# EAGLE design ReSpeaker_Switch_V02 (EAGLE 9.3.0)

## Sheet 1 of 2
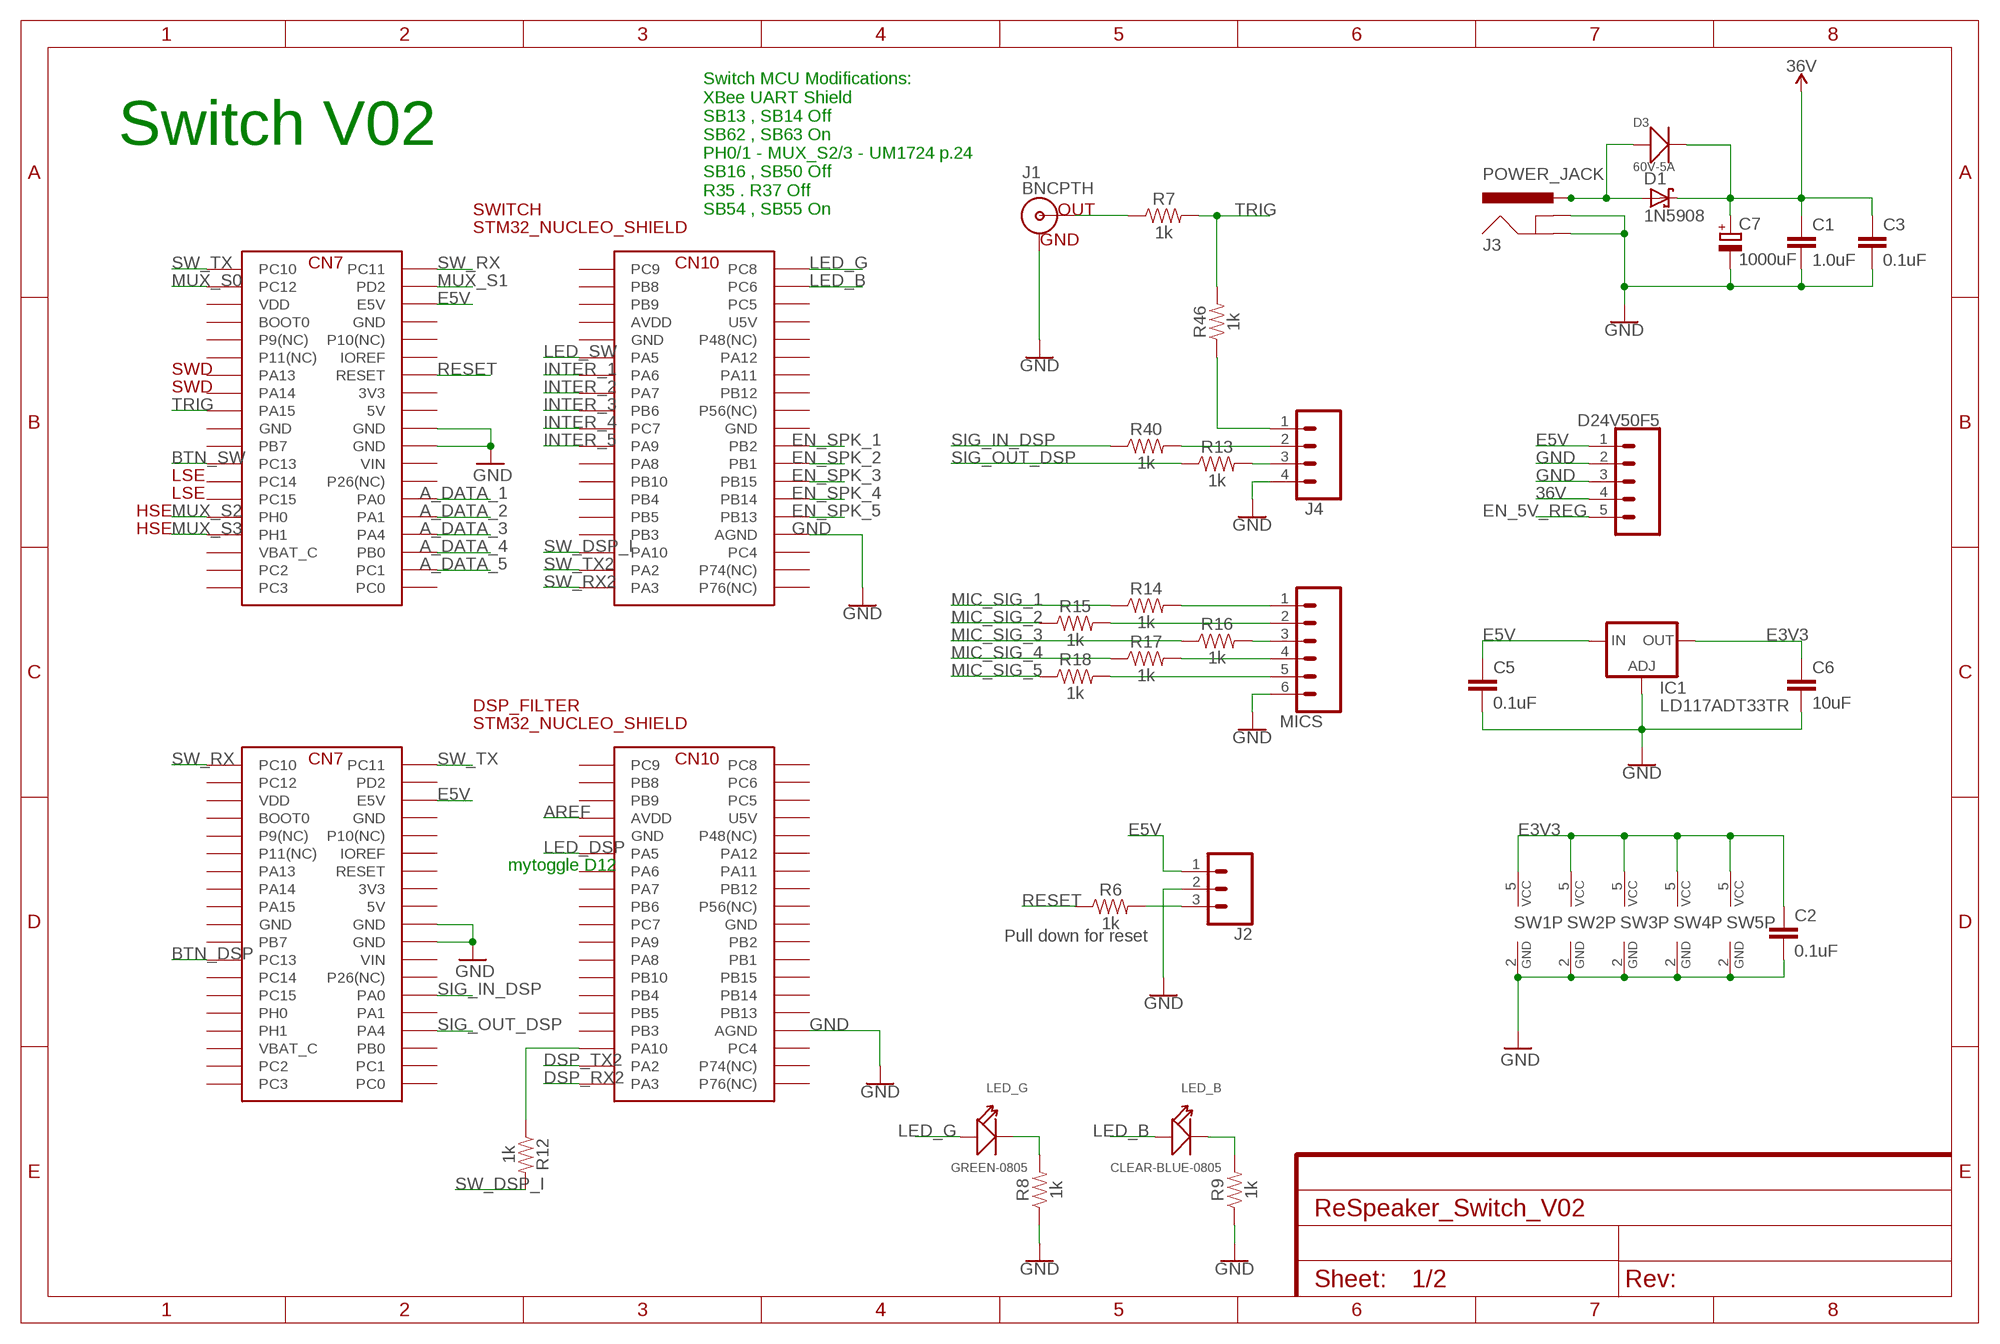
[diagram p0: schematic, sheet 1]

### Parts
C1  1.0uF  1.0UF-0805-25V-10%  [0805]
C2  0.1uF  1.0UF-0805-25V-10%  [0805]
C3  0.1uF  1.0UF-0805-25V-10%  [0805]
C5  0.1uF  1.0UF-0805-25V-10%  [0805]
C6  10uF  1.0UF-0805-25V-10%  [0805]
C7  1000uF  CPOL-EUE7.5-16  [E7,5-16]
D1  1N5908  [C4111-15]
D3  60V-5A  SMD-DIODE-SCHOTTKY-40V-3A(DO-214AB)  [DO-214AB]
D24V50F5  CONN_05  [1X05]
DSP_FILTER  STM32_NUCLEO_SHIELD  [STM32_NUCLEO]
IC1  LD117ADT33TR  [DPACK]
J1  BNCPTH  [BNC]
J2  CONN_03POLAR  [MOLEX-1X3]
J3  POWER_JACK  [POWER_JACK_PTH]
J4  CONN_04POLAR  [MOLEX-1X4]
LED_B  CLEAR-BLUE-0805  SMD-LED-CLEAR-BLUE(0805)  [LED-0805]
LED_G  GREEN-0805  SMD-LED-CLEAR-GREEN(0805)  [LED-0805]
MICS  CONN_06POLAR  [MOLEX-1X6]
R6  1k  RESISTOR0805  [0805]
R7  1k  RESISTOR0805  [0805]
R8  1k  RESISTOR0805  [0805]
R9  1k  RESISTOR0805  [0805]
R12  1k  RESISTOR0805  [0805]
R13  1k  RESISTOR0805  [0805]
R14  1k  RESISTOR0805  [0805]
R15  1k  RESISTOR0805  [0805]
R16  1k  RESISTOR0805  [0805]
R17  1k  RESISTOR0805  [0805]
R18  1k  RESISTOR0805  [0805]
R40  1k  RESISTOR0805  [0805]
R46  1k  RESISTOR0805  [0805]
SW1  741G3157DBVR  [DBV_R-PDSO-G6]
SW2  741G3157DBVR  [DBV_R-PDSO-G6]
SW3  741G3157DBVR  [DBV_R-PDSO-G6]
SW4  741G3157DBVR  [DBV_R-PDSO-G6]
SW5  741G3157DBVR  [DBV_R-PDSO-G6]
SWITCH  STM32_NUCLEO_SHIELD  [STM32_NUCLEO]

### Nets
36V: C1.1 C3.1 C7.+ D1.C D3.2(-) D24V50F5.4 ; also sheet 2
A_DATA_1: SWITCH.PA0 ; also sheet 2
A_DATA_2: SWITCH.PA1 ; also sheet 2
A_DATA_3: SWITCH.PA4 ; also sheet 2
A_DATA_4: SWITCH.PB0 ; also sheet 2
A_DATA_5: SWITCH.PC1 ; also sheet 2
AREF: DSP_FILTER.AVDD
BTN_DSP: DSP_FILTER.PC13
BTN_SW: SWITCH.PC13
DSP_RX2: DSP_FILTER.PA3
DSP_TX2: DSP_FILTER.PA2
E3V3: C2.1 C6.1 IC1.4(OUT) SW1.5(VCC) SW2.5(VCC) SW3.5(VCC) SW4.5(VCC) SW5.5(VCC) ; also sheet 2
E5V: C5.1 D24V50F5.1 DSP_FILTER.E5V IC1.3(IN) J2.1 SWITCH.E5V ; also sheet 2
EN_5V_REG: D24V50F5.5
EN_SPK_1: SWITCH.PB2 ; also sheet 2
EN_SPK_2: SWITCH.PB1 ; also sheet 2
EN_SPK_3: SWITCH.PB15 ; also sheet 2
EN_SPK_4: SWITCH.PB14 ; also sheet 2
EN_SPK_5: SWITCH.PB13 ; also sheet 2
GND [Power]: C1.2 C2.2 C3.2 C5.2 C6.2 C7.- D24V50F5.2 D24V50F5.3 DSP_FILTER.AGND DSP_FILTER.GND@20(GND) DSP_FILTER.GND@22(GND) IC1.1(ADJ) J1.GND J2.2 J3.GND J3.GNDBREAK J4.4 MICS.6 R8.1 R9.1 SW1.2(GND) SW2.2(GND) SW3.2(GND) SW4.2(GND) SW5.2(GND) SWITCH.AGND SWITCH.GND@20(GND) SWITCH.GND@22(GND) ; also sheet 2
INTER_1: SWITCH.PA6 ; also sheet 2
INTER_2: SWITCH.PA7 ; also sheet 2
INTER_3: SWITCH.PB6 ; also sheet 2
INTER_4: SWITCH.PC7 ; also sheet 2
INTER_5: SWITCH.PA9 ; also sheet 2
LED_B: LED_B.+ SWITCH.PC6
LED_DSP: DSP_FILTER.PA5
LED_G: LED_G.+ SWITCH.PC8
LED_SW: SWITCH.PA5
MIC_SIG_1: R14.1 ; also sheet 2
MIC_SIG_2: R15.1 ; also sheet 2
MIC_SIG_3: R16.1 ; also sheet 2
MIC_SIG_4: R17.1 ; also sheet 2
MIC_SIG_5: R18.1 ; also sheet 2
MUX_S0: SWITCH.PC12 ; also sheet 2
MUX_S1: SWITCH.PD2 ; also sheet 2
MUX_S2: SWITCH.PH0 ; also sheet 2
MUX_S3: SWITCH.PH1 ; also sheet 2
N$1: DSP_FILTER.PA10 R12.1
N$2: D1.A D3.1(+) J3.PWR
N$6: J1.S(OUT) R7.1
N$9: J2.3 R6.2
N$10: MICS.1 R14.2
N$11: LED_G.- R8.2
N$12: LED_B.- R9.2
N$13: MICS.2 R15.2
N$14: MICS.3 R16.2
N$15: MICS.4 R17.2
N$16: MICS.5 R18.2
N$17: J4.2 R40.2
N$32: J4.3 R13.2
N$34: J4.1 R46.1
RESET: R6.1 SWITCH.RESET
SIG_IN_DSP: DSP_FILTER.PA0 R40.1 ; also sheet 2
SIG_OUT_DSP: DSP_FILTER.PA4 R13.1 ; also sheet 2
SW_DSP_I: R12.2 SWITCH.PA10
SW_RX: DSP_FILTER.PC10 SWITCH.PC11
SW_RX2: SWITCH.PA3
SW_TX: DSP_FILTER.PC11 SWITCH.PC10
SW_TX2: SWITCH.PA2
TRIG: R7.2 R46.2 SWITCH.PA15
Unconnected: DSP_FILTER.BOOT0 DSP_FILTER.IOREF DSP_FILTER.P9(NC) DSP_FILTER.P10(NC) DSP_FILTER.P11(NC) DSP_FILTER.P26(NC) DSP_FILTER.P48(NC) DSP_FILTER.P56(NC) DSP_FILTER.P74(NC) DSP_FILTER.P76(NC) DSP_FILTER.PA1 DSP_FILTER.PA6 DSP_FILTER.PA7 DSP_FILTER.PA8 DSP_FILTER.PA9 DSP_FILTER.PA11 DSP_FILTER.PA12 DSP_FILTER.PA13 DSP_FILTER.PA14 DSP_FILTER.PA15 DSP_FILTER.PB0 DSP_FILTER.PB1 DSP_FILTER.PB2 DSP_FILTER.PB3 DSP_FILTER.PB4 DSP_FILTER.PB5 DSP_FILTER.PB6 DSP_FILTER.PB7 DSP_FILTER.PB8 DSP_FILTER.PB9 DSP_FILTER.PB10 DSP_FILTER.PB12 DSP_FILTER.PB13 DSP_FILTER.PB14 DSP_FILTER.PB15 DSP_FILTER.PC0 DSP_FILTER.PC1 DSP_FILTER.PC2 DSP_FILTER.PC3 DSP_FILTER.PC4 DSP_FILTER.PC5 DSP_FILTER.PC6 DSP_FILTER.PC7 DSP_FILTER.PC8 DSP_FILTER.PC9 DSP_FILTER.PC12 DSP_FILTER.PC14 DSP_FILTER.PC15 DSP_FILTER.PD2 DSP_FILTER.PH0 DSP_FILTER.PH1 DSP_FILTER.RESET SWITCH.BOOT0 SWITCH.IOREF SWITCH.P9(NC) SWITCH.P10(NC) SWITCH.P11(NC) SWITCH.P26(NC) SWITCH.P48(NC) SWITCH.P56(NC) SWITCH.P74(NC) SWITCH.P76(NC) SWITCH.PA8 SWITCH.PA11 SWITCH.PA12 SWITCH.PA13 SWITCH.PA14 SWITCH.PB3 SWITCH.PB4 SWITCH.PB5 SWITCH.PB7 SWITCH.PB8 SWITCH.PB9 SWITCH.PB10 SWITCH.PB12 SWITCH.PC0 SWITCH.PC2 SWITCH.PC3 SWITCH.PC4 SWITCH.PC5 SWITCH.PC9 SWITCH.PC14 SWITCH.PC15

### Notes on the sheet
- Switch V02
- Switch MCU Modifications:
  XBee UART Shield 
  SB13 , SB14 Off
  SB62 , SB63 On
  PH0/1 - MUX_S2/3 - UM1724 p.24
  SB16 , SB50 Off
  R35 . R37 Off
  SB54 , SB55 On
- SWD
- SWD
- LSE
- LSE
- HSE
- HSE
- mytoggle D12
- Pull down for reset

## Sheet 2 of 2
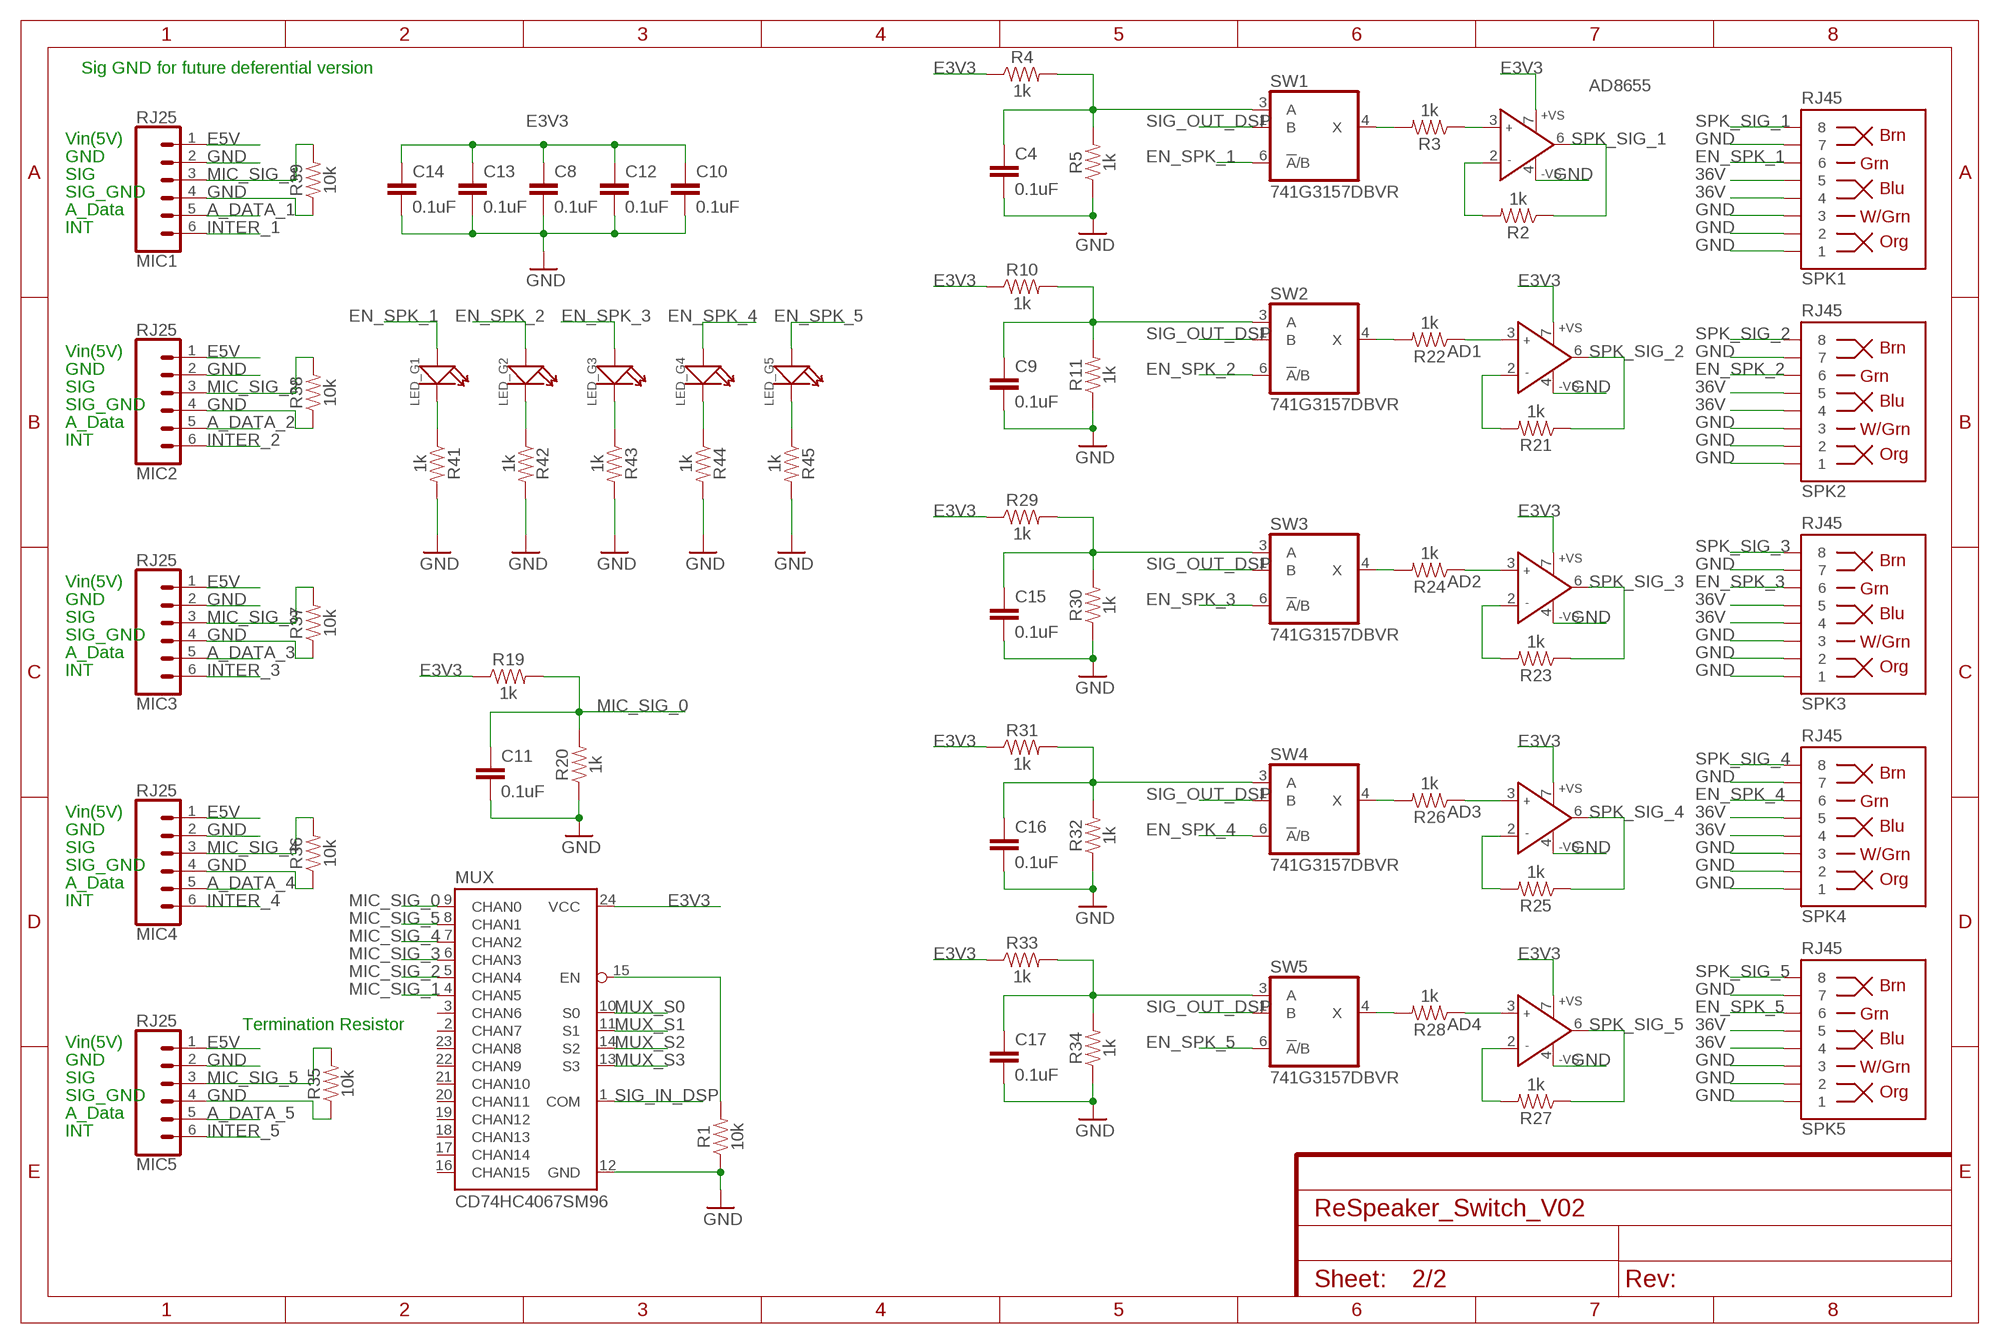
[diagram p1: schematic, sheet 2]

### Parts
AD1  AD8655R  [SO8]
AD2  AD8655R  [SO8]
AD3  AD8655R  [SO8]
AD4  AD8655R  [SO8]
AD8655  AD8655R  [SO8]
C4  0.1uF  1.0UF-0805-25V-10%  [0805]
C8  0.1uF  1.0UF-0805-25V-10%  [0805]
C9  0.1uF  1.0UF-0805-25V-10%  [0805]
C10  0.1uF  1.0UF-0805-25V-10%  [0805]
C11  0.1uF  1.0UF-0805-25V-10%  [0805]
C12  0.1uF  1.0UF-0805-25V-10%  [0805]
C13  0.1uF  1.0UF-0805-25V-10%  [0805]
C14  0.1uF  1.0UF-0805-25V-10%  [0805]
C15  0.1uF  1.0UF-0805-25V-10%  [0805]
C16  0.1uF  1.0UF-0805-25V-10%  [0805]
C17  0.1uF  1.0UF-0805-25V-10%  [0805]
LED_G1  GREEN-0805  SMD-LED-CLEAR-GREEN(0805)  [LED-0805]
LED_G2  GREEN-0805  SMD-LED-CLEAR-GREEN(0805)  [LED-0805]
LED_G3  GREEN-0805  SMD-LED-CLEAR-GREEN(0805)  [LED-0805]
LED_G4  GREEN-0805  SMD-LED-CLEAR-GREEN(0805)  [LED-0805]
LED_G5  GREEN-0805  SMD-LED-CLEAR-GREEN(0805)  [LED-0805]
MIC1  RJ25  RJ11-6  [RJ11-6]
MIC2  RJ25  RJ11-6  [RJ11-6]
MIC3  RJ25  RJ11-6  [RJ11-6]
MIC4  RJ25  RJ11-6  [RJ11-6]
MIC5  RJ25  RJ11-6  [RJ11-6]
MUX  CD74HC4067SM96  74HC4067SM96  [SSOP24]
R1  10k  RESISTOR0805  [0805]
R2  1k  RESISTOR0805  [0805]
R3  1k  RESISTOR0805  [0805]
R4  1k  RESISTOR0805  [0805]
R5  1k  RESISTOR0805  [0805]
R10  1k  RESISTOR0805  [0805]
R11  1k  RESISTOR0805  [0805]
R19  1k  RESISTOR0805  [0805]
R20  1k  RESISTOR0805  [0805]
R21  1k  RESISTOR0805  [0805]
R22  1k  RESISTOR0805  [0805]
R23  1k  RESISTOR0805  [0805]
R24  1k  RESISTOR0805  [0805]
R25  1k  RESISTOR0805  [0805]
R26  1k  RESISTOR0805  [0805]
R27  1k  RESISTOR0805  [0805]
R28  1k  RESISTOR0805  [0805]
R29  1k  RESISTOR0805  [0805]
R30  1k  RESISTOR0805  [0805]
R31  1k  RESISTOR0805  [0805]
R32  1k  RESISTOR0805  [0805]
R33  1k  RESISTOR0805  [0805]
R34  1k  RESISTOR0805  [0805]
R35  10k  RESISTOR0805  [0805]
R36  10k  RESISTOR0805  [0805]
R37  10k  RESISTOR0805  [0805]
R38  10k  RESISTOR0805  [0805]
R39  10k  RESISTOR0805  [0805]
R41  1k  RESISTOR0805  [0805]
R42  1k  RESISTOR0805  [0805]
R43  1k  RESISTOR0805  [0805]
R44  1k  RESISTOR0805  [0805]
R45  1k  RESISTOR0805  [0805]
SPK1  RJ45  RJ45-8  [RJ45-8]
SPK2  RJ45  RJ45-8  [RJ45-8]
SPK3  RJ45  RJ45-8  [RJ45-8]
SPK4  RJ45  RJ45-8  [RJ45-8]
SPK5  RJ45  RJ45-8  [RJ45-8]

### Nets
36V: SPK1.4 SPK1.5 SPK2.4 SPK2.5 SPK3.4 SPK3.5 SPK4.4 SPK4.5 SPK5.4 SPK5.5 ; also sheet 1
A_DATA_1: MIC1.5 ; also sheet 1
A_DATA_2: MIC2.5 ; also sheet 1
A_DATA_3: MIC3.5 ; also sheet 1
A_DATA_4: MIC4.5 ; also sheet 1
A_DATA_5: MIC5.5 ; also sheet 1
E3V3: AD1.7(+VS) AD2.7(+VS) AD3.7(+VS) AD4.7(+VS) AD8655.7(+VS) C8.1 C10.1 C12.1 C13.1 C14.1 MUX.24(VCC) R4.1 R10.1 R19.1 R29.1 R31.1 R33.1 ; also sheet 1
E5V: MIC1.1 MIC2.1 MIC3.1 MIC4.1 MIC5.1 ; also sheet 1
EN_MUX: MUX.15(EN) R1.2
EN_SPK_1: LED_G1.+ SPK1.6 SW1.6(!A!/B) ; also sheet 1
EN_SPK_2: LED_G2.+ SPK2.6 SW2.6(!A!/B) ; also sheet 1
EN_SPK_3: LED_G3.+ SPK3.6 SW3.6(!A!/B) ; also sheet 1
EN_SPK_4: LED_G4.+ SPK4.6 SW4.6(!A!/B) ; also sheet 1
EN_SPK_5: LED_G5.+ SPK5.6 SW5.6(!A!/B) ; also sheet 1
GND [Power]: AD1.4(-VS) AD2.4(-VS) AD3.4(-VS) AD4.4(-VS) AD8655.4(-VS) C4.2 C8.2 C9.2 C10.2 C11.2 C12.2 C13.2 C14.2 C15.2 C16.2 C17.2 MIC1.2 MIC1.4 MIC2.2 MIC2.4 MIC3.2 MIC3.4 MIC4.2 MIC4.4 MIC5.2 MIC5.4 MUX.12(GND) R1.1 R5.1 R11.1 R20.1 R30.1 R32.1 R34.1 R35.1 R36.1 R37.1 R38.1 R39.1 R41.2 R42.2 R43.2 R44.2 R45.2 SPK1.1 SPK1.2 SPK1.3 SPK1.7 SPK2.1 SPK2.2 SPK2.3 SPK2.7 SPK3.1 SPK3.2 SPK3.3 SPK3.7 SPK4.1 SPK4.2 SPK4.3 SPK4.7 SPK5.1 SPK5.2 SPK5.3 SPK5.7 ; also sheet 1
INTER_1: MIC1.6 ; also sheet 1
INTER_2: MIC2.6 ; also sheet 1
INTER_3: MIC3.6 ; also sheet 1
INTER_4: MIC4.6 ; also sheet 1
INTER_5: MIC5.6 ; also sheet 1
MIC_SIG_0: C11.1 MUX.9(CHAN0) R19.2 R20.2
MIC_SIG_1: MIC1.3 MUX.4(CHAN5) R39.2 ; also sheet 1
MIC_SIG_2: MIC2.3 MUX.5(CHAN4) R38.2 ; also sheet 1
MIC_SIG_3: MIC3.3 MUX.6(CHAN3) R37.2 ; also sheet 1
MIC_SIG_4: MIC4.3 MUX.7(CHAN2) R36.2 ; also sheet 1
MIC_SIG_5: MIC5.3 MUX.8(CHAN1) R35.2 ; also sheet 1
MUX_S0: MUX.10(S0) ; also sheet 1
MUX_S1: MUX.11(S1) ; also sheet 1
MUX_S2: MUX.14(S2) ; also sheet 1
MUX_S3: MUX.13(S3) ; also sheet 1
N$3: R3.2 SW1.4(X)
N$4: AD8655.3(IN+) R3.1
N$5: AD8655.2(IN-) R2.2
N$7: C4.1 R4.2 R5.2 SW1.3(A)
N$8: C9.1 R10.2 R11.2 SW2.3(A)
N$18: AD1.2(IN-) R21.2
N$19: AD2.2(IN-) R23.2
N$20: AD1.3(IN+) R22.1
N$21: AD2.3(IN+) R24.1
N$22: AD3.2(IN-) R25.2
N$23: AD3.3(IN+) R26.1
N$24: AD4.2(IN-) R27.2
N$25: AD4.3(IN+) R28.1
N$26: C15.1 R29.2 R30.2 SW3.3(A)
N$27: R22.2 SW2.4(X)
N$28: C16.1 R31.2 R32.2 SW4.3(A)
N$29: R24.2 SW3.4(X)
N$30: C17.1 R33.2 R34.2 SW5.3(A)
N$31: R26.2 SW4.4(X)
N$33: R28.2 SW5.4(X)
N$35: LED_G1.- R41.1
N$37: LED_G2.- R42.1
N$39: LED_G3.- R43.1
N$41: LED_G4.- R44.1
N$43: LED_G5.- R45.1
SIG_IN_DSP: MUX.1(COM) ; also sheet 1
SIG_OUT_DSP: SW1.1(B) SW2.1(B) SW3.1(B) SW4.1(B) SW5.1(B) ; also sheet 1
SPK_SIG_1: AD8655.6(OUT) R2.1 SPK1.8
SPK_SIG_2: AD1.6(OUT) R21.1 SPK2.8
SPK_SIG_3: AD2.6(OUT) R23.1 SPK3.8
SPK_SIG_4: AD3.6(OUT) R25.1 SPK4.8
SPK_SIG_5: AD4.6(OUT) R27.1 SPK5.8
Unconnected: MUX.2(CHAN7) MUX.3(CHAN6) MUX.16(CHAN15) MUX.17(CHAN14) MUX.18(CHAN13) MUX.19(CHAN12) MUX.20(CHAN11) MUX.21(CHAN10) MUX.22(CHAN9) MUX.23(CHAN8)

### Notes on the sheet
- Sig GND for future deferential version
- Vin(5V)
- GND
- SIG
- SIG_GND
- A_Data
- INT
- Vin(5V)
- GND
- SIG
- SIG_GND
- A_Data
- INT
- Vin(5V)
- GND
- SIG
- SIG_GND
- A_Data
- INT
- Vin(5V)
- GND
- SIG
- SIG_GND
- A_Data
- INT
- Termination Resistor
- Vin(5V)
- GND
- SIG
- SIG_GND
- A_Data
- INT

## Power pins joined to a net without a drawn wire
3V3: DSP_FILTER.3V3 SWITCH.3V3
5V: DSP_FILTER.5V SWITCH.5V
AVDD: SWITCH.AVDD
GND: DSP_FILTER.GND@8(GND) DSP_FILTER.GND@19(GND) DSP_FILTER.GND@47(GND) DSP_FILTER.GND@58(GND) SWITCH.GND@8(GND) SWITCH.GND@19(GND) SWITCH.GND@47(GND) SWITCH.GND@58(GND)
U5V: DSP_FILTER.U5V SWITCH.U5V
VBAT_C: DSP_FILTER.VBAT_C SWITCH.VBAT_C
VDD: DSP_FILTER.VDD SWITCH.VDD
VIN: DSP_FILTER.VIN SWITCH.VIN

## Library data of the parts
AD1-AD4 AD8655 = analog-devices:AD8655: Low Noise, Precision CMOS Amplifier Source: http://www.analog.com/static/imported-files/data_sheets/AD8655_8656.pdf; MF: ALTERA CORPORATION; MPN: AD8655ARMZ-REEL; OC_FARNELL: 1078267; OC_NEWARK: 59K7050
C1 = SparkFun-Capacitors:1.0UF: 1µF ceramic capacitors A capacitor is a passive two-terminal electrical component used to store electrical energy temporarily in an electric field.; PROD_ID: CAP-08064
C2-C6 C8-C17 = SparkFun-Capacitors:1.0UF: 1µF ceramic capacitors A capacitor is a passive two-terminal electrical component used to store electrical energy temporarily in an electric field.; PROD_ID: CAP-08064; VALUE: 1.0uF
C7 = rcl:CPOL-EU: POLARIZED CAPACITOR, European symbol; SPICEPREFIX: C
D1 = diode:1N5908: DIODE schottky
D3 = Seeed-OPL-Diode:SMD-DIODE-SCHOTTKY-40V-3A(DO-214AB): 304020018; MPN: SS34-E3/57T; VALUE: 40V-3A
D24V50F5 = SparkFun-Connectors:CONN_05: Multi connection point. Often used as Generic Header-pin footprint for 0.1 inch spaced/style header connections On any of the 0.1 inch spaced packages, you can populate with these: Break Away Headers - Straight <https://www.sparkfun.com/products/116> (PRT-00116) Break Away Male Headers - Right Angle <https://www.sparkfun.com/products/553> (PRT-00553) Female Headers <https://www.sparkfun.com/products/115> (PRT-00115) Break Away Headers - Machine Pin <https://www.sparkfun.com/products/117> (PRT-00117) Break Away Female Headers - Swiss Machine Pin <https://www.sparkfun.com/products/743> (PRT-00743) For SCREWTERMINALS and SPRING TERMINALS visit here: Screw Terimnals on SparkFun.com <https://www.sparkfun.com/search/results?term=Screw+Terminals> (5mm/3.5mm/2.54mm spacing) This device is also useful as a general connection point to wire up your design to another part of your project. Our various solder wires solder well into these plated through hole pads. Hook-Up Wire - Assortment (Stranded, 22 AWG) <https://www.sparkfun.com/products/11375> (PRT-11375) Hook-Up Wire - Assortment (Solid Core, 22 AWG) <https://www.sparkfun.com/products/11367> (PRT-11367) View the entire wire category on our website here <https://www.sparkfun.com/categories/141> Special notes: Molex polarized connector foot print use with SKU : PRT-08231 with associated crimp pins and housings. 1MM SMD Version SKU: PRT-10208
DSP_FILTER SWITCH = Stm32_Nucleo_STM32F446:STM32_NUCLEO_SHIELD: STM32 Nucleo Shield STM32F446RE Pinout
IC1 = v-reg:LD117A?*: Low drop fixed and adjustable positive voltage regulators 1 A Source: http://www.st.com/stonline/products/literature/ds/7194/ld1117axx.pdf
J1 = SparkFun-Connectors:BNC: BNC Right Angle Connector Mouser Part# 5227161 SparkFun Products: BNC Connector - Right Angle <https://www.sparkfun.com/products/10550>; PROD_ID: LPA-12729; SF_ID: PRT-10550
J2 = SparkFun-Connectors:CONN_03: Multi connection point. Often used as Generic Header-pin footprint for 0.1 inch spaced/style header connections On any of the 0.1 inch spaced packages, you can populate with these: Break Away Headers - Straight <https://www.sparkfun.com/products/116> (PRT-00116) Break Away Male Headers - Right Angle <https://www.sparkfun.com/products/553> (PRT-00553) Female Headers <https://www.sparkfun.com/products/115> (PRT-00115) Break Away Headers - Machine Pin <https://www.sparkfun.com/products/117> (PRT-00117) Break Away Female Headers - Swiss Machine Pin <https://www.sparkfun.com/products/743> (PRT-00743) Stackable Header - 3 Pin (Female, 0.1") <https://www.sparkfun.com/products/13875> (PRT-13875) For SCREWTERMINALS and SPRING TERMINALS visit here: Screw Terimnals on SparkFun.com <https://www.sparkfun.com/search/results?term=Screw+Terminals> (5mm/3.5mm/2.54mm spacing) This device is also useful as a general connection point to wire up your design to another part of your project. Our various solder wires solder well into these plated through hole pads. Hook-Up Wire - Assortment (Stranded, 22 AWG) <https://www.sparkfun.com/products/11375> (PRT-11375) Hook-Up Wire - Assortment (Solid Core, 22 AWG) <https://www.sparkfun.com/products/11367> (PRT-11367) View the entire wire category on our website here <https://www.sparkfun.com/categories/141> Special notes: Molex polarized connector foot print use with SKU : PRT-08232 with associated crimp pins and housings.; PROD_ID: CONN-08625; SF_ID: PRT-08096
J3 = SparkFun-Connectors:POWER_JACK: Power Jack Connector This is the standard 5.5mm barrel jack for power. The PTH is the most common, proven, reliable, footprint. The Slot footprint only works if the mill layer is transmitted to the PCB fab house so be warned. Here are the connectors we sell at SparkFun: DC Barrel Power Jack/Connector <https://www.sparkfun.com/products/119> (PRT-00119) DC Barrel Power Jack/Connector (SMD) <https://www.sparkfun.com/products/12748> (PRT-12748) DC Barrel Jack Adapter - Breadboard Compatible <https://www.sparkfun.com/products/10811> (PRT-10811) It is used on this SparkFun product (and many, many others): SparkFun RedBoard - Programmed with Arduino <https://www.sparkfun.com/products/12757> (DEV-12757) Also, if you need a mating power supply or connector, please check these out: Wall Adapter Power Supply - 9VDC 650mA <https://www.sparkfun.com/products/298> (TOL-00298) DC Barrel Jack Adapter - Male <https://www.sparkfun.com/products/10287> (PRT-10287); PROD_ID: CONN-08197
J4 = SparkFun-Connectors:CONN_04: Multi connection point. Often used as Generic Header-pin footprint for 0.1 inch spaced/style header connections On any of the 0.1 inch spaced packages, you can populate with these: Break Away Headers - Straight <https://www.sparkfun.com/products/116> (PRT-00116) Break Away Male Headers - Right Angle <https://www.sparkfun.com/products/553> (PRT-00553) Female Headers <https://www.sparkfun.com/products/115> (PRT-00115) Break Away Headers - Machine Pin <https://www.sparkfun.com/products/117> (PRT-00117) Break Away Female Headers - Swiss Machine Pin <https://www.sparkfun.com/products/743> (PRT-00743) For SCREWTERMINALS and SPRING TERMINALS visit here: Screw Terimnals on SparkFun.com <https://www.sparkfun.com/search/results?term=Screw+Terminals> (5mm/3.5mm/2.54mm spacing) This device is also useful as a general connection point to wire up your design to another part of your project. Our various solder wires solder well into these plated through hole pads. Hook-Up Wire - Assortment (Stranded, 22 AWG) <https://www.sparkfun.com/products/11375> (PRT-11375) Hook-Up Wire - Assortment (Solid Core, 22 AWG) <https://www.sparkfun.com/products/11367> (PRT-11367) View the entire wire category on our website here <https://www.sparkfun.com/categories/141> Special notes: Molex polarized connector foot print use with SKU : PRT-08231 with associated crimp pins and housings. 1MM SMD Version SKU: PRT-10208; PROD_ID: CONN-08186; SF_ID: PRT-08231
LED_B = Seeed-LED:SMD-LED-CLEAR-BLUE(0805): 304090061; MPN: EL-17-215/BHC-AN1P2/3T
LED_G LED_G1-LED_G5 = Seeed-LED:SMD-LED-CLEAR-GREEN(0805): 304090057; MPN: 17-215SYGC/S530-E2/TR8
MIC1-MIC5 = SparkFun-Connectors:RJ11-6: RJ11 Jack - 6 pin Commonly found on CAT3 devices and some Microchip programmers. Here is the connector we sell at SparkFun: RJ11 6-Pin Connector <https://www.sparkfun.com/products/132> (PRT-00132) Datasheet <http://www.sparkfun.com/datasheets/Prototyping/Connectors/RJ11-Datasheet.pdf> It is used on this SparkFun product: SparkFun Weather Shield <https://www.sparkfun.com/products/12081> (DEV-12081) Weather Meters <https://www.sparkfun.com/products/8942> (SEN-08942); PROD_ID: CONN-08590; SF_ID: PRT-00132; VALUE: RJ11
MICS = SparkFun-Connectors:CONN_06: Multi connection point. Often used as Generic Header-pin footprint for 0.1 inch spaced/style header connections On any of the 0.1 inch spaced packages, you can populate with these: Break Away Headers - Straight <https://www.sparkfun.com/products/116> (PRT-00116) Break Away Male Headers - Right Angle <https://www.sparkfun.com/products/553> (PRT-00553) Female Headers <https://www.sparkfun.com/products/115> (PRT-00115) Break Away Headers - Machine Pin <https://www.sparkfun.com/products/117> (PRT-00117) Break Away Female Headers - Swiss Machine Pin <https://www.sparkfun.com/products/743> (PRT-00743) Arduino Stackable Header - 6 Pin <https://www.sparkfun.com/products/9280> (PRT-09280) For SCREWTERMINALS and SPRING TERMINALS visit here: Screw Terimnals on SparkFun.com <https://www.sparkfun.com/search/results?term=Screw+Terminals> (5mm/3.5mm/2.54mm spacing) This device is also useful as a general connection point to wire up your design to another part of your project. Our various solder wires solder well into these plated through hole pads. Hook-Up Wire - Assortment (Stranded, 22 AWG) <https://www.sparkfun.com/products/11375> (PRT-11375) Hook-Up Wire - Assortment (Solid Core, 22 AWG) <https://www.sparkfun.com/products/11367> (PRT-11367) View the entire wire category on our website here <https://www.sparkfun.com/categories/141>
MUX = SparkFun-IC-Logic:74*4067: 16-channel analog MUX Datasheet <http://www.sparkfun.com/datasheets/IC/cd74hc4067.pdf> SparkFun Products MP3 Trigger <https://www.sparkfun.com/products/13720> (WIG-13720) SparkFun Analog/Digital MUX Breakout - CD74HC4067 <https://www.sparkfun.com/products/9056> (BOB-09056); PROD_ID: IC-08252
R1-R46 = SparkFun-Resistors:RESISTOR: Generic Resistor Package
SPK1-SPK5 = SparkFun-Connectors:RJ45-8: RJ45 Jack - 8 pin Simple RJ45, 8-pin connection. Commonly used for Cat5, Cat5e, and Cat6 Ethernet cables. Here is the connector we sell at SparkFun: RJ45 8-Pin Connector <https://www.sparkfun.com/products/643> (PRT-00643) Datasheet <https://cdn.sparkfun.com/datasheets/Prototyping/04908.pdf> It is used on this SparkFun product: SparkFun RJ45 Breakout <https://www.sparkfun.com/products/716> (BOB-00716) Note, you may also be interested in the "MAGJACK" version of this. It is basically a RJ45 connector, but also has some status LEDs built into the connector housing. You can check that out in this library at the device named "MAGJACK.dev" and see these products online: RJ45 Ethernet MagJack-Compatible <https://www.sparkfun.com/products/8534> (PRT-08534) SparkFun RJ45 MagJack Breakout <https://www.sparkfun.com/products/13021> (BOB-13021); PROD_ID: CONN-08506; SF_ID: PRT-00643
SW1-SW5 = 74xx-little-us:74*1G3157: Single-Pole, Double-Throw Analog Switch Source: http://focus.ti.com/lit/ds/symlink/sn74lvc1g3157.pdf

## Net classes
0 default: width 0.254 mm, drill 0.3 mm, clearance 0.254 mm
1 Power: width 0.254 mm, drill 0.3 mm, clearance 0.254 mm to class 0, clearance 0.254 mm

## Board
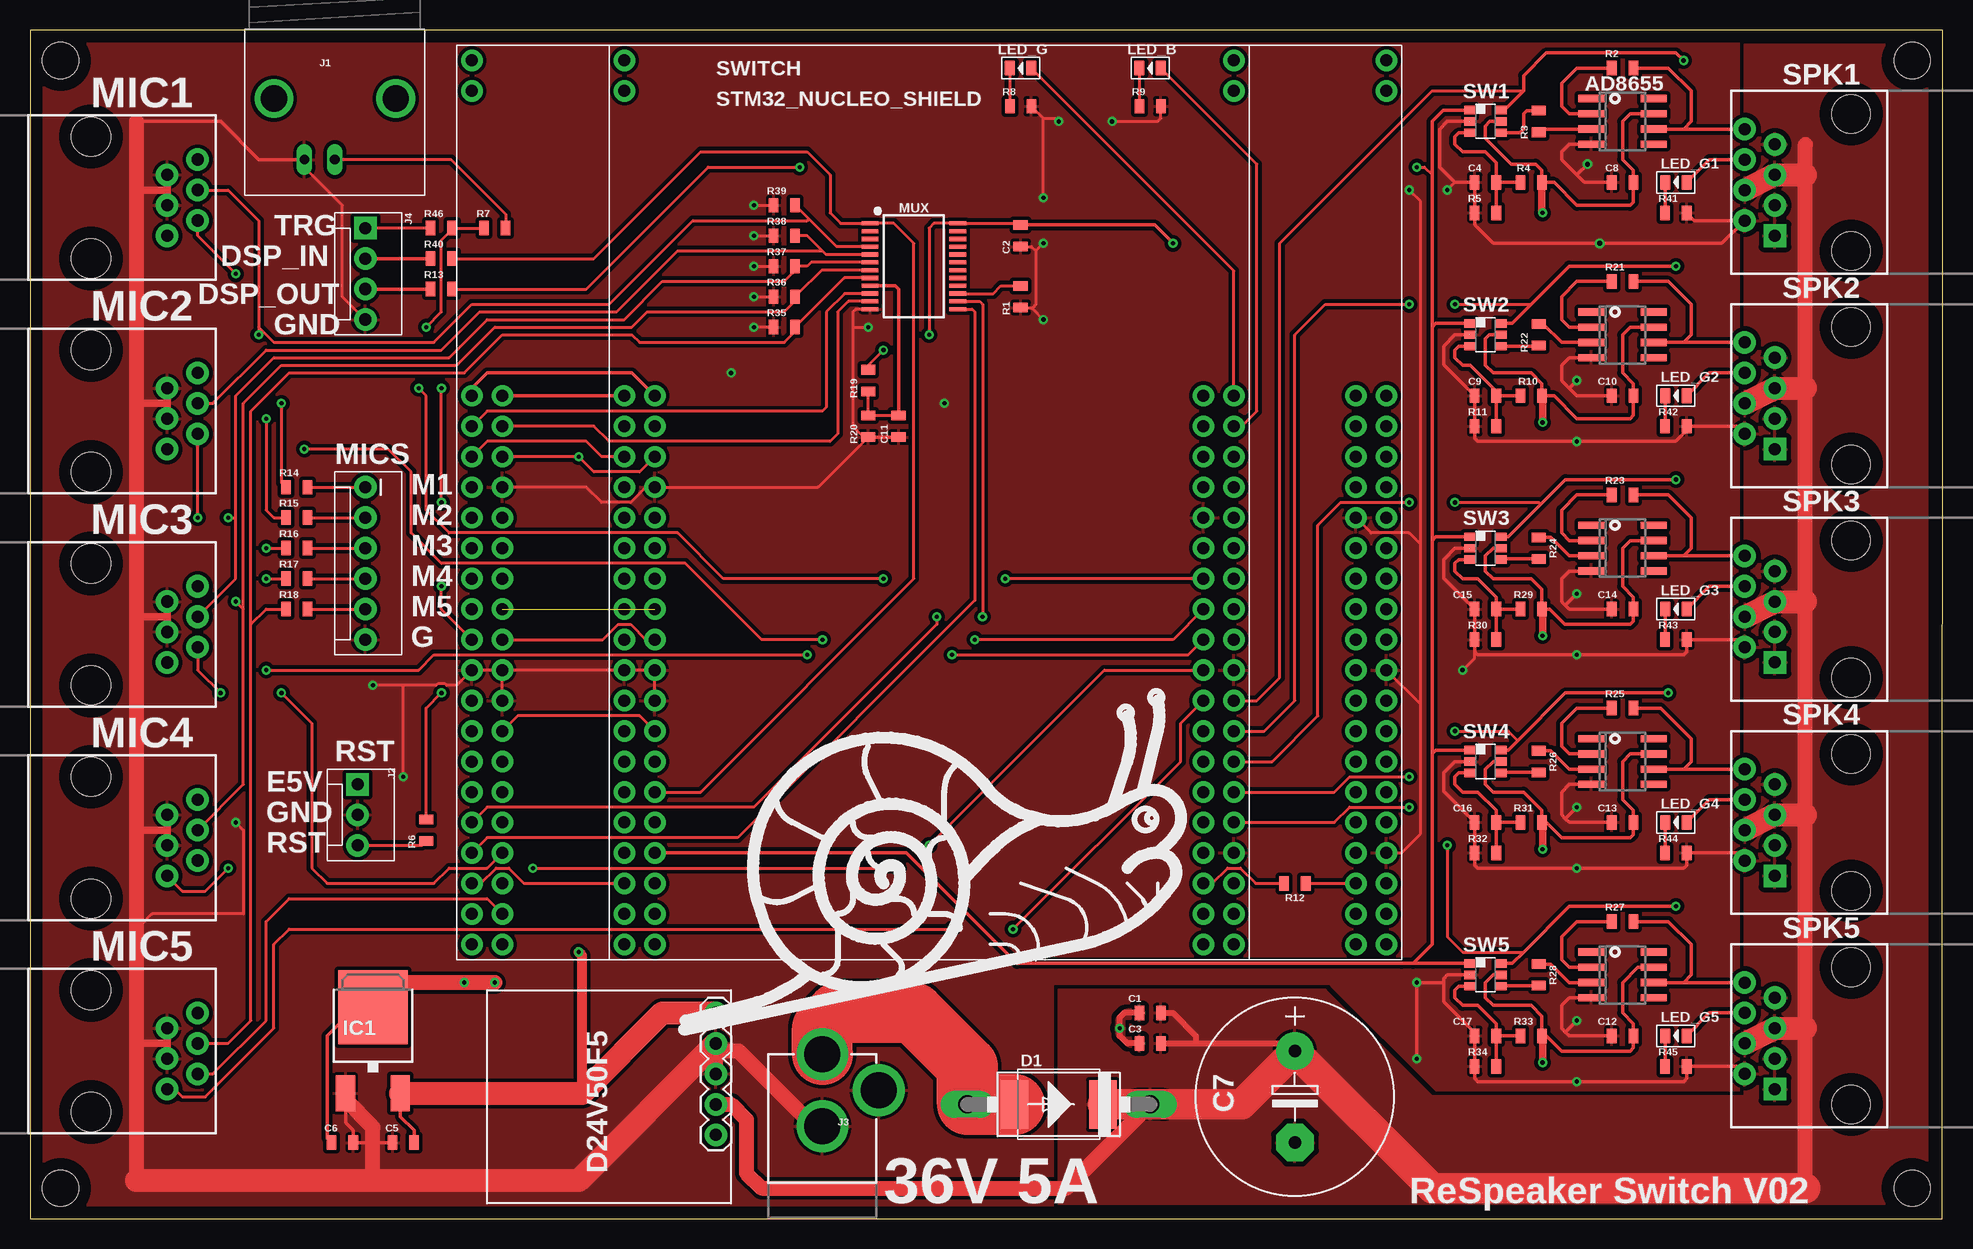
[diagram p2: board, top side]
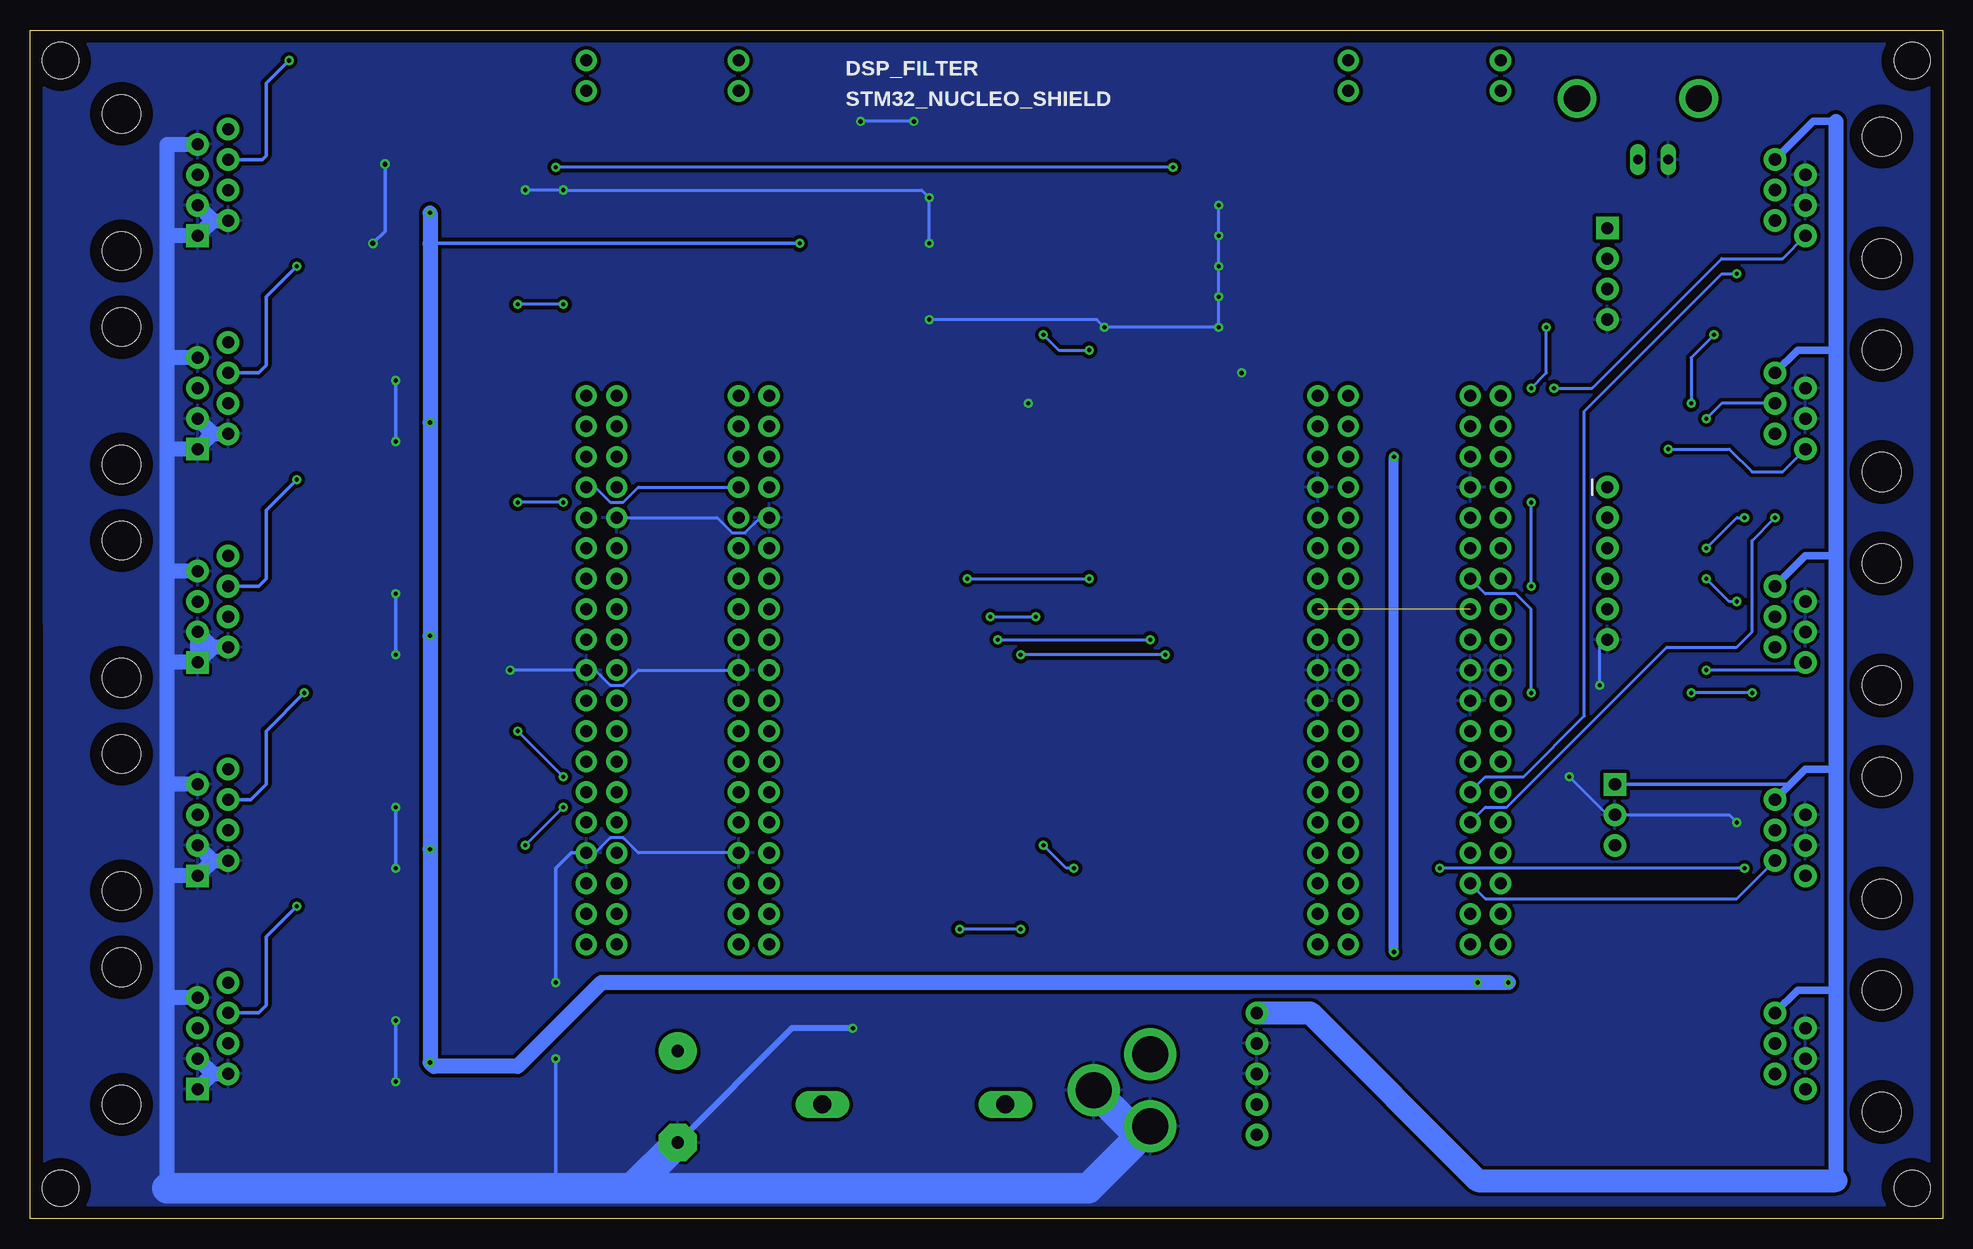
[diagram p3: board, bottom side, seen from below]

Size 159.38 x 99.06 mm. Coordinates in mm from the lower left corner, seen from the top.
Outline: 0,0 159.37,0 159.38,99.06 0,99.06 0,0
Copper layers (1*16): Top 0.035mm / dielectric 1.5mm / Bottom 0.035mm
Design rules "default *": minimum track width 10mil, minimum drill 0.3mm, track to track 10mil, track to pad 10mil, pad to pad 10mil, via to via 10mil, smd to smd 10mil, copper to edge 40mil, drill to drill 8mil, minimum pad ring 10mil, minimum via ring 8mil, stop-mask expansion 4mil, vias tented up to drill 25mil, thermal gap 10mil
Holes 3 mm at 156.84,96.52 156.84,2.54 2.54,2.54 2.54,96.52

### Footprints (pad centres in the part's own frame; a part is rotated, then mirrored left to right if it is on the bottom)
SO8 = smd 0.6 x 2.2: 1 -1.905,-2.6; 2 -0.635,-2.6; 3 0.635,-2.6; 4 1.905,-2.6; 5 1.905,2.6; 6 0.635,2.6; 7 -0.635,2.6; 8 -1.905,2.6
0805 = smd 0.8 x 1.2: 1 -0.9,0; 2 0.9,0
E7,5-16 = drill 1.016 pad 3.15: + -3.81,0 | drill 1.016 pad 3.15 octagon: - 3.81,0
C4111-15 = drill 1.499 long: A 7.62,0; C -7.62,0
DO-214AB = smd 2.286 x 4.064: 1 -3.683,0; 2 3.683,0
1X05 = drill 1.016 pad 1.88: 1 0,0; 2 2.54,0; 3 5.08,0; 4 7.62,0; 5 10.16,0
STM32_NUCLEO = drill 1 pad 1.778: 3V3 -29.21,27.94; 5V -29.21,25.4; AGND 31.75,7.62; AVDD 29.21,38.1; BOOT0 -31.75,38.1; E5V -29.21,40.64; GND@8 -29.21,38.1; GND@19 -31.75,22.86; GND@20 -29.21,22.86; GND@22 -29.21,20.32; GND@47 29.21,35.56; GND@58 31.75,22.86; IOREF -29.21,33.02; OPT_GND1 -31.75,73.66; OPT_GND2 -31.75,71.12; OPT_GND_3 31.75,73.66; OPT_GND_4 31.75,71.12; P9(NC) -31.75,35.56; P10(NC) -29.21,35.56; P11(NC) -31.75,33.02; P26(NC) -29.21,15.24; P48(NC) 31.75,35.56; P56(NC) 31.75,25.4; P74(NC) 31.75,2.54; P76(NC) 31.75,0; PA0 -29.21,12.7; PA1 -29.21,10.16; PA2 29.21,2.54; PA3 29.21,0; PA4 -29.21,7.62; PA5 29.21,33.02; PA6 29.21,30.48; PA7 29.21,27.94; PA8 29.21,17.78; PA9 29.21,20.32; PA10 29.21,5.08; PA11 31.75,30.48; PA12 31.75,33.02; PA13 -31.75,30.48; PA14 -31.75,27.94; PA15 -31.75,25.4; PB0 -29.21,5.08; PB1 31.75,17.78; PB2 31.75,20.32; PB3 29.21,7.62; PB4 29.21,12.7; PB5 29.21,10.16; PB6 29.21,25.4; PB7 -31.75,20.32; PB8 29.21,43.18; PB9 29.21,40.64; PB10 29.21,15.24; PB12 31.75,27.94; PB13 31.75,10.16; PB14 31.75,12.7; PB15 31.75,15.24; PC0 -29.21,0; PC1 -29.21,2.54; PC2 -31.75,2.54; PC3 -31.75,0; PC4 31.75,5.08; PC5 31.75,40.64; PC6 31.75,43.18; PC7 29.21,22.86; PC8 31.75,45.72; PC9 29.21,45.72; PC10 -31.75,45.72; PC11 -29.21,45.72; PC12 -31.75,43.18; PC13 -31.75,17.78; PC14 -31.75,15.24; PC15 -31.75,12.7; PD2 -29.21,43.18; PH0 -31.75,10.16; PH1 -31.75,7.62; RESET -29.21,30.48; U5V 31.75,38.1; VBAT_C -31.75,5.08; VDD -31.75,40.64; VIN -29.21,17.78
DPACK = smd 1.6 x 3: 1 -2.28,-4.8; 3 2.28,-4.8 | smd 5.8 x 6.2: 4 0,2.38
BNC = drill 2.2: 3 -5.08,5.08; 4 5.08,5.08 | drill 0.8 long: GND -2.54,0; S 0,0
MOLEX-1X3 = drill 1.016 pad 1.88 square: 1 0,0 | drill 1.016 pad 1.88: 2 2.54,0; 3 5.08,0
POWER_JACK_PTH = drill 2.997 pad 4.318: GND 0,7.7; GNDBREAK 4.7,10.7; PWR 0,13.7
MOLEX-1X4 = drill 1.016 pad 1.88 square: 1 0,0 | drill 1.016 pad 1.88: 2 2.54,0; 3 5.08,0; 4 7.62,0
LED-0805 = smd 0.889 x 1.27: + -0.889,0; - 0.889,0
RJ11-6 = drill 1.016 pad 1.88: 1 -3.175,8.89; 2 -1.905,6.35; 3 -0.635,8.89; 4 0.635,6.35; 5 1.905,8.89; 6 3.175,6.35 | hole 3.251: -5.08,0; 5.08,0
MOLEX-1X6 = drill 1.016 pad 1.88: 1 0,0; 2 2.54,0; 3 5.08,0; 4 7.62,0; 5 10.16,0; 6 12.7,0
SSOP24 = smd 0.348 x 1.397: 1 -3.575,-3.656; 2 -2.925,-3.656; 3 -2.275,-3.656; 4 -1.625,-3.656; 5 -0.975,-3.656; 6 -0.325,-3.656; 7 0.325,-3.656; 8 0.975,-3.656; 9 1.625,-3.656; 10 2.275,-3.656; 11 2.925,-3.656; 12 3.575,-3.656; 13 3.575,3.656; 14 2.925,3.656; 15 2.275,3.656; 16 1.625,3.656; 17 0.975,3.656; 18 0.325,3.656; 19 -0.325,3.656; 20 -0.975,3.656; 21 -1.625,3.656; 22 -2.275,3.656; 23 -2.925,3.656; 24 -3.575,3.656
RJ45-8 = drill 1 pad 1.88 square: 1 -4.445,6.35 | drill 1 pad 1.88: 2 -3.175,8.89; 3 -1.905,6.35; 4 -0.635,8.89; 5 0.635,6.35; 6 1.905,8.89; 7 3.175,6.35; 8 4.445,8.89 | hole 3.2: -5.715,0; 5.715,0
DBV_R-PDSO-G6 = smd 0.69 x 0.99: 1 -0.95,-1.29; 2 0,-1.29; 3 0.95,-1.29; 4 0.95,1.3; 5 0,1.3; 6 -0.95,1.3

### Placement (x,y rotation side)
AD1  132.72,73.66 270 top
AD2  132.72,55.88 270 top
AD3  132.72,38.1 270 top
AD4  132.72,20.32 270 top
AD8655  132.72,91.44 270 top
C1  93.34,17.14 180 top
C2  82.55,81.92 270 top
C3  93.34,14.61 180 top
C4  121.28,86.36 180 top
C5  31.11,6.35 180 top
C6  26.04,6.35 0 top
C7  105.41,10.16 270 top
C8  132.72,86.36 180 top
C9  121.28,68.58 180 top
C10  132.72,68.58 180 top
C11  72.39,66.04 270 top
C12  132.72,15.24 180 top
C13  132.72,33.02 180 top
C14  132.72,50.8 180 top
C15  121.28,50.8 180 top
C16  121.28,33.02 180 top
C17  121.28,15.24 180 top
D1  85.72,9.53 180 top
D3  85.72,9.53 0 top
D24V50F5  57.15,17.14 270 top
DSP_FILTER  81.28,22.86 0 top
IC1  28.57,15.24 0 top
J1  25.4,88.27 0 top
J2  27.3,36.2 270 top
J3  66.04,0 0 top
J4  27.94,82.55 270 top
LED_B  93.34,95.89 180 top
LED_G  82.55,95.89 180 top
LED_G1  137.16,86.36 180 top
LED_G2  137.16,68.58 180 top
LED_G3  137.16,50.8 180 top
LED_G4  137.16,33.02 180 top
LED_G5  137.16,15.24 180 top
MIC1  5.08,85.09 270 top
MIC2  5.08,67.31 270 top
MIC3  5.08,49.53 270 top
MIC4  5.08,31.75 270 top
MIC5  5.08,13.97 270 top
MICS  27.94,60.96 270 top
MUX  73.66,79.38 270 top
R1  82.55,76.83 90 top
R2  132.72,95.89 180 top
R3  125.73,91.44 90 top
R4  125.09,86.36 180 top
R5  121.28,83.82 0 top
R6  33.02,32.38 270 top
R7  38.73,82.55 180 top
R8  82.55,92.71 180 top
R9  93.34,92.71 180 top
R10  125.09,68.58 180 top
R11  121.28,66.04 0 top
R12  105.41,27.94 180 top
R13  34.29,77.47 180 top
R14  22.23,60.96 0 top
R15  22.23,58.42 0 top
R16  22.23,55.88 0 top
R17  22.23,53.34 0 top
R18  22.23,50.8 0 top
R19  69.85,69.85 270 top
R20  69.85,66.04 90 top
R21  132.72,78.11 180 top
R22  125.73,73.66 270 top
R23  132.72,60.33 180 top
R24  125.73,55.88 270 top
R25  132.72,42.55 180 top
R26  125.73,38.1 270 top
R27  132.72,24.77 180 top
R28  125.73,20.32 270 top
R29  125.09,50.8 180 top
R30  121.28,48.26 0 top
R31  125.09,33.02 180 top
R32  121.28,30.48 0 top
R33  125.09,15.24 180 top
R34  121.28,12.7 0 top
R35  62.87,74.3 0 top
R36  62.87,76.83 0 top
R37  62.87,79.38 0 top
R38  62.87,81.92 0 top
R39  62.87,84.45 0 top
R40  34.29,80.01 180 top
R41  137.16,83.82 0 top
R42  137.16,66.04 0 top
R43  137.16,48.26 0 top
R44  137.16,30.48 0 top
R45  137.16,12.7 0 top
R46  34.29,82.55 0 top
SPK1  151.76,86.36 90 top
SPK2  151.76,68.58 90 top
SPK3  151.76,50.8 90 top
SPK4  151.76,33.02 90 top
SPK5  151.76,15.24 90 top
SW1  121.28,91.44 270 top
SW2  121.28,73.66 270 top
SW3  121.28,55.88 270 top
SW4  121.28,38.1 270 top
SW5  121.28,20.32 270 top
SWITCH  68.58,22.86 0 top

### Tracks (layer width: path | path; a pad name or v marks a point on that pad's centre or on a via)
3V3  (1 unrouted)
5V
  Top 0.254: SWITCH.5V 47.73,48.26 49,49.53 50.06,49.53 51.33,48.26 DSP_FILTER.5V
36V
  Top 0.508: C3.1 97.16,14.61 | 97.16,14.61 104.78,14.61 C7.+ | C1.1 95.25,17.14 97.16,15.24 97.16,14.61
  Top 1.27: 147.96,2.54 147.96,15.88 147.96,33.66 147.96,51.44 147.96,69.22 147.96,87 147.96,89.53 | D24V50F5.4 58.42,9.53 59.69,8.26 59.69,3.81 60.96,2.54 86.36,2.54 D1.C
  Top 1.905: SPK1.4 SPK1.5 147.96,87 | SPK2.4 SPK2.5 147.96,69.22 | SPK3.4 SPK3.5 147.96,51.44 | SPK4.4 SPK4.5 147.96,33.66 | SPK5.4 SPK5.5 147.96,15.88
  Top 2.54: D3.2 D1.C 100.97,9.53 C7.+ 116.84,2.54 147.96,2.54
  pour Top (isolate 0.406): 85.72,1.27 158.12,1.27 158.12,97.79 142.88,97.79 142.88,10.16 116.84,10.16 107.95,19.05 85.72,19.05
A_DATA_1  (via drill 0.35)
  Top 0.254: v17.14,78.74 13.97,81.92 MIC1.5
  Bottom 0.254: SWITCH.PA0 38.1,36.83 34.92,36.83 29.84,41.91 29.84,67.31 18.41,78.74 v17.14,78.74
A_DATA_2  (via drill 0.35)
  Top 0.254: v13.97,58.42 MIC2.5
  Bottom 0.254: SWITCH.PA1 38.1,34.29 36.3,34.29 22.97,47.62 17.14,47.62 15.88,48.9 15.88,56.52 v13.97,58.42
A_DATA_3  (via drill 0.35)
  Top 0.254: MIC3.5 13.97,45.72 v15.88,43.81 | v20.95,43.81 23.5,41.27 23.5,29.21 24.77,27.94 33.66,27.94 34.92,29.21 38.1,29.21 SWITCH.PA4
  Bottom 0.254: v15.88,43.81 v20.95,43.81
A_DATA_4
  Bottom 0.254: SWITCH.PB0 38.1,26.67 17.14,26.67 MIC4.5
A_DATA_5
  Top 0.254: MIC5.5 15.24,12.06 19.68,16.51 19.68,24.77 21.59,26.67 38.1,26.67 SWITCH.PC1
E3V3  (via drill 0.35)
  Top 0.254: C2.1 82.42,82.95 MUX.24 75.33,82.95 74.93,82.55 v74.93,73.66 | v71.12,72.39 69.85,71.12 R19.1
  Top 0.305: SW1.5 121.67,91.44 121.28,91.06 121.28,90.04 123.44,87.88 125.48,87.88 126,87.36 R4.1 127,86.36 128.91,84.45 133.35,84.45 133.62,84.72 C8.1 133.62,87.36 132.72,88.27 132.72,91.44 133.35,92.08 AD8655.7 | AD1.7 133.35,74.3 132.72,73.66 132.72,70.48 133.62,69.58 C10.1 133.62,66.94 133.35,66.67 128.91,66.67 127,68.58 R10.1 | R10.1 126,69.58 125.09,70.48 121.92,70.48 121.28,71.12 121.28,73.34 121.6,73.66 SW2.5 | AD2.7 133.35,56.52 132.72,55.88 132.72,52.7 133.62,51.8 C14.1 133.62,49.8 133.35,49.53 127.9,49.53 126.63,50.8 126.05,50.8 R29.1 126,52.44 125.09,53.34 121.92,53.34 121.28,53.98 121.28,55.24 121.92,55.88 SW3.5 | AD3.7 133.35,38.73 132.72,38.1 132.72,34.92 133.62,34.02 C13.1 133.62,32.02 133.35,31.75 127.64,31.75 126.36,33.02 | AD4.7 133.99,20.95 132.72,19.68 132.72,17.14 133.62,16.25 C12.1 133.62,14.23 133.35,13.97 127.64,13.97 126.36,15.24 R33.1 | SW4.5 121.92,38.1 121.28,37.47 121.28,36.2 121.92,35.56 124.46,35.56 126,34.02 R31.1 126.36,33.02 | SW5.5 121.92,20.32 121.28,19.68 121.28,18.41 121.92,17.78 125.09,17.78 126,16.88 R33.1 | 126,83.87 v126.05,83.82 | 126.05,68.53 R10.1 | 126.05,32.7 126.36,33.02 | 126.05,15.19 R33.1 | C6.1 24.77,6.72 24.77,15.24 27.14,17.62 27.94,17.62 IC1.4 | C2.1 93.72,82.81 v95.25,81.28
  Top 0.61: R4.1 126,83.87 | v126.05,66.36 126.05,68.53 | v126.05,48.58 126.05,50.8 | v126.05,30.8 126.05,32.7 | v126.05,13.02 126.05,15.19
  Top 1.27: v38.73,19.68 30,19.68 27.94,17.62
  Bottom 0.254: v74.93,73.66 73.66,72.39 v71.12,72.39
  Bottom 0.305: v95.25,81.28 126.05,81.28
  Bottom 1.27: v126.05,83.82 126.05,81.28 v126.05,66.36 v126.05,48.58 v126.05,30.8 v126.05,13.02 125.73,12.7 118.75,12.7 111.76,19.68 v38.73,19.68 v36.2,19.68
E5V  (via drill 0.35)
  Top 0.254: DSP_FILTER.E5V 50.8,62.23 46.99,62.23 v45.72,63.5 SWITCH.E5V
  Top 0.305: IC1.3 30.86,8.52 32.02,7.36 C5.1
  Top 0.813: 46,10.44 46,21.95 v45.72,22.23
  Top 1.905: IC1.3 46,10.44 52.7,17.14 D24V50F5.1
  Bottom 0.305: J2.1 12.7,36.2 11.43,37.47
  Bottom 0.61: MIC1.1 10.79,91.44 8.89,91.44 | MIC2.1 12.06,72.39 8.89,72.39 | MIC3.1 11.43,55.24 8.89,55.24 | MIC4.1 11.43,37.47 8.89,37.47 | MIC5.1 12.06,19.05 8.89,19.05
  Bottom 0.813: v45.72,22.23 v45.72,63.5
  Bottom 1.27: 8.89,91.44 8.89,72.39 8.89,55.24 8.89,37.47 8.89,19.05 8.89,3.17
  Bottom 1.905: D24V50F5.1 52.7,17.14 38.73,3.17 8.89,3.17
EN_MUX
  Top 0.254: MUX.15 80.28,77.1 80.91,77.73 R1.2
EN_SPK_1  (via drill 0.35)
  Top 0.254: SWITCH.PB2 102.23,43.18 104.14,45.09 104.14,81.28 116.84,93.98 124.46,93.98
  Top 0.305: SW1.6 122.87,92.39 124.46,93.98 124.46,95.25 126.36,97.16 137.16,97.16 v137.79,96.52 | SPK1.6 139.95,88.27 LED_G1.+
  Bottom 0.305: SPK1.6 140.02,88.27 139.7,88.58 139.7,94.61 v137.79,96.52
EN_SPK_2  (via drill 0.35)
  Top 0.254: SWITCH.PB1 102.87,40.64 105.41,43.18 105.41,73.66 107.95,76.2 v114.94,76.2 | v118.75,76.2 125.09,76.2
  Top 0.305: SW2.6 123.5,74.61 125.09,76.2 128.27,79.38 v137.16,79.38 | LED_G2.+ 139.95,70.48 SPK2.6
  Bottom 0.254: v114.94,76.2 v118.75,76.2
  Bottom 0.305: v137.16,79.38 139.7,76.83 139.7,71.12 140.34,70.48 SPK2.6
EN_SPK_3  (via drill 0.35)
  Top 0.254: SWITCH.PB15 103.5,38.1 107.31,41.91 107.31,57.78 109.22,59.69 v114.94,59.69 | v118.75,59.69 125.73,59.69 125.89,59.53
  Top 0.305: LED_G3.+ 139.95,52.7 SPK3.6 | SW3.6 123.19,56.83 125.89,59.53 127.95,61.59 v137.16,61.59
  Bottom 0.254: v114.94,59.69 v118.75,59.69
  Bottom 0.305: v137.16,61.59 139.7,59.05 139.7,53.34 140.34,52.7 SPK3.6
EN_SPK_4  (via drill 0.35)
  Top 0.254: SWITCH.PB14 108.69,35.56 109.96,36.83 v114.94,36.83 | v118.75,40.64 123.19,40.64 123.98,39.85
  Top 0.305: LED_G4.+ 139.95,34.92 SPK4.6 | SW4.6 123.19,39.05 123.98,39.85 127.95,43.81 v136.53,43.81
  Bottom 0.254: v114.94,36.83 v118.75,40.64
  Bottom 0.305: v136.53,43.81 139.7,40.64 139.7,36.2 140.97,34.92 SPK4.6
EN_SPK_5  (via drill 0.35)
  Top 0.254: SWITCH.PB13 108.69,33.02 109.96,34.29 v114.94,34.29 | v118.11,31.11 118.11,23.5 119.38,22.23 124.46,22.23
  Top 0.305: SPK5.6 139.95,17.14 LED_G5.+ | SW5.6 123.5,21.27 124.46,22.23 128.27,26.04 v137.16,26.04
  Bottom 0.254: v114.94,34.29 v118.11,31.11
  Bottom 0.305: v137.16,26.04 139.7,23.5 139.7,17.78 140.34,17.14 SPK5.6
GND  (via drill 0.35, 0.4)
  Top 0.254: 112.29,30.48 DSP_FILTER.AGND 114.3,30.48 115.89,32.07 115.89,42.86 | 115.89,42.86 DSP_FILTER.GND@58 | 115.89,42.86 115.89,56.2 | DSP_FILTER.GND@47 111.76,57.15 114.94,57.15 115.89,56.2 | v119.38,45.72 120.39,46.73 120.39,47.26 | 115.89,56.2 115.89,84.77 v114.94,85.72 | v118.11,85.72 118.75,86.36 | MUX.12 68.81,75.8 68.58,75.56 68.58,74.3 | 68.58,74.3 68.58,66.04 69.48,65.14 R20.1 65.67,60.96 DSP_FILTER.GND@8 51.33,60.96 50.06,59.69 47.62,59.69 46.35,60.96 SWITCH.GND@8 | R1.1 83.56,75.94 | 83.56,75.94 83.82,76.2 83.82,80.64 | C2.2 83.45,81.02 83.82,80.64 | 83.82,80.64 v84.45,81.28 | v84.45,85.09 84.45,91.7 | 84.45,91.7 R8.1 | 84.45,91.7 85.46,91.7 v85.72,91.44 | v90.17,91.44 93.98,91.44 94.25,91.7 R9.1 | 68.58,74.3 v69.85,74.3 | v84.45,74.93 83.56,75.83 83.56,75.94 | SWITCH.GND@20 DSP_FILTER.GND@19 DSP_FILTER.GND@20 DSP_FILTER.GND@22 | SWITCH.GND@22 SWITCH.GND@20 | SWITCH.GND@20 SWITCH.GND@19 35.56,44.45 34.73,44.45 34.6,44.57 33.98,44.57 33.85,44.45 31.11,44.45 | J4.4 26.04,76.83 26.04,84.45 22.86,87.63 J1.GND | R35.1 v60.33,74.3 | v60.33,76.83 R36.1 | v60.33,79.38 R37.1 | v60.33,81.92 R38.1 | v60.33,84.45 R39.1 | v17.14,33.02 17.78,32.38 17.78,25.4 10.16,25.4 8.89,24.13 | 31.11,44.45 v28.57,44.45 | v31.11,36.83 31.11,44.45
  Top 0.305: SW1.2 118.11,91.44 117.47,90.81 117.47,87.63 118.75,86.36 C4.2 R5.1 120.39,82.81 121.92,81.28 v130.81,81.28 140.97,81.28 SPK1.2 138.69,83.19 R41.2 | AD8655.4 128.27,89.53 127.64,88.9 127.64,88.27 128.91,87 | C8.2 129.54,86.36 128.91,87 | 128.91,87 v129.79,87.88 | SPK2.2 142.24,66.04 138.43,66.04 | 138.43,66.04 R42.2 | SW2.2 118.75,73.66 117.79,72.71 117.79,71.17 C9.2 R11.1 120.39,65.03 120.65,64.77 v128.91,64.77 137.16,64.77 138.43,66.04 | AD1.4 128.27,71.75 127.64,71.12 127.64,69.85 128.27,69.22 | 128.27,69.22 128.91,68.58 C10.2 | 128.27,69.22 v128.91,69.85 | SPK3.2 142.24,48.26 R43.2 138.06,47.26 137.79,46.99 v128.91,46.99 120.65,46.99 120.39,47.26 R30.1 C15.2 117.79,53.39 117.79,54.93 118.75,55.88 SW3.2 | SPK4.2 142.24,30.48 R44.2 138.06,29.48 137.79,29.21 v128.91,29.21 120.65,29.21 120.39,29.48 R32.1 C16.2 117.79,35.61 117.79,37.15 118.75,38.1 SW4.2 | SPK5.2 142.24,12.7 R45.2 138.06,11.7 137.79,11.43 v128.91,11.43 120.65,11.43 120.39,11.7 R34.1 C17.2 120.39,15.51 117.79,18.1 117.79,19.68 | SW5.2 118.11,20.32 117.79,20 117.79,19.68 | AD2.4 128.27,53.98 127.64,53.34 127.64,51.44 127.95,51.12 | 127.95,51.12 128.27,50.8 C14.2 | 127.95,51.12 v128.91,52.07 | AD3.4 128.27,36.2 127.64,35.56 127.64,33.66 127.95,33.34 | 127.95,33.34 128.27,33.02 C13.2 | 127.95,33.34 v128.91,34.29 | 127.95,15.56 127.64,15.88 127.64,17.78 128.27,18.41 AD4.4 | 127.95,15.56 128.27,15.24 C12.2 | 127.95,15.56 v128.91,16.51 | C5.2 C6.2 26.93,7.36 26.3,8 IC1.1 | 8.89,91.44 15.88,91.44 19.05,88.27 J1.GND | C11.2 R20.1 | 117.79,19.68 v115.57,19.68 v115.57,13.34
  Top 0.508: C1.2 91.17,17.14 90.81,16.77 v90.81,15.88 90.81,15.24 91.44,14.61 C3.2
  Top 0.61: MIC1.2 11.43,85.72 | 11.43,85.72 MIC1.4 | 11.43,85.72 8.89,85.72 | MIC2.2 11.43,67.94 | 11.43,67.94 MIC2.4 | 11.43,67.94 8.89,67.94 | MIC3.2 11.43,50.16 | 11.43,50.16 MIC3.4 | 11.43,50.16 8.89,50.16 | MIC4.2 11.43,32.38 | 11.43,32.38 MIC4.4 | 11.43,32.38 8.89,32.38 | MIC5.2 11.43,14.61 | 11.43,14.61 MIC5.4 | 11.43,14.61 8.89,14.61
  Top 1.27: D24V50F5.3 D24V50F5.2 57.78,13.97 59.05,13.97 65.33,7.7 J3.GND | 8.89,3.17 8.89,14.61 8.89,24.13 8.89,32.38 8.89,50.16 8.89,67.94 8.89,85.72 8.89,91.44 | 28.57,3.17 28.57,7.62 26.3,9.9 IC1.1
  Top 1.905: D24V50F5.2 45.72,3.17 28.57,3.17 8.89,3.17
  Bottom 0.254: DSP_FILTER.GND@47 102.13,58.42 100.86,57.15 99.8,57.15 98.53,58.42 SWITCH.GND@47 | SWITCH.AGND 108.69,30.48 109.96,31.75 111.02,31.75 112.29,30.48 DSP_FILTER.AGND | SWITCH.GND@58 108.69,45.72 109.96,44.45 111.02,44.45 112.29,45.72 DSP_FILTER.GND@58 v119.38,45.72 | v118.11,85.72 v114.94,85.72 85.09,85.72 v84.45,85.09 v84.45,81.28 | v85.72,91.44 v90.17,91.44 | v84.45,74.93 70.48,74.93 v69.85,74.3 v60.33,74.3 v60.33,76.83 v60.33,79.38 v60.33,81.92 v60.33,84.45 | v17.14,33.02 17.78,33.66 J2.2 27.94,33.66 v31.11,36.83 | v28.57,44.45 28.57,47.62 MICS.6
  Bottom 0.305: v129.79,87.88 129.79,82.3 v130.81,81.28 | v128.91,69.85 v128.91,64.77 | v128.91,52.07 v128.91,46.99 | v128.91,34.29 v128.91,29.21 | v128.91,16.51 v128.91,11.43 | DSP_FILTER.AGND 114.3,30.48 115.57,29.21 v115.57,19.68 | v115.57,13.34 115.57,2.54
  Bottom 0.508: v90.81,15.88 95.89,15.88 C7.-
  Bottom 1.27: SPK5.1 144.15,12.06 | 144.15,12.06 SPK5.2 | SPK5.3 144.15,12.06 | 147.96,2.54 147.96,18.41 | 147.96,18.41 147.96,28.57 | 147.96,28.57 147.96,36.2 | 147.96,36.2 147.96,46.35 | 147.96,46.35 147.96,53.98 | 147.96,53.98 147.96,64.14 | 147.96,64.14 147.96,71.75 | 147.96,71.75 147.96,81.92 | 147.96,81.92 147.96,89.53 SPK1.7 | SPK1.3 144.15,83.19 | 144.15,83.19 SPK1.2 | 144.15,83.19 SPK1.1 147.96,81.92 | SPK2.3 144.15,65.41 | 144.15,65.41 SPK2.2 | 144.15,65.41 SPK2.1 147.96,64.14 | SPK2.7 147.96,71.75 | SPK3.1 SPK3.3 144.15,47.62 | SPK3.2 144.15,47.62 | 144.15,47.62 SPK3.1 | SPK3.1 147.96,46.35 | SPK3.7 147.96,53.98 | SPK4.7 147.96,36.2 | 144.15,29.84 SPK4.1 147.96,28.57 | 144.15,29.84 SPK4.2 | 144.15,29.84 SPK4.3 | SPK5.7 147.96,18.41
  Bottom 2.54: J3.GNDBREAK 67.74,7.7 J3.GND 71.2,2.54 109.22,2.54 | 109.22,2.54 115.57,2.54 147.96,2.54 | C7.- 109.22,2.54
  other vias: 76.2,67.94 58.42,70.48
  pour Top (isolate 0.305, rank 2): 0.64,0.64 158.75,0.64 158.75,98.42 0.64,98.42
  pour Bottom (isolate 0.305, rank 2): 0.64,0.64 158.75,0.64 158.75,98.42 0.64,98.42
INTER_1  (via drill 0.35)
  Top 0.254: SWITCH.PA6 v81.28,53.34 | v71.12,53.34 57.78,53.34 53.98,57.15 34.92,57.15 33.02,59.05 33.02,68.58 v32.38,69.22
  Bottom 0.254: v81.28,53.34 v71.12,53.34 | v32.38,69.22 29.21,69.22 18.41,80.01 13.34,80.01 MIC1.6
INTER_2  (via drill 0.35)
  Top 0.254: SWITCH.PA7 95.25,48.26 v78.74,48.26 | v66.04,48.26 60.96,48.26 54.61,54.61 34.29,54.61 31.75,57.15 31.75,62.23 29.84,64.14 v22.86,64.14
  Bottom 0.254: v78.74,48.26 v66.04,48.26 | v22.86,64.14 17.78,64.14 15.88,62.23 13.34,62.23 MIC2.6
INTER_3  (via drill 0.35)
  Top 0.254: v76.83,46.99 96.52,46.99 SWITCH.PB6 | v19.68,45.72 32.38,45.72 33.66,46.99 v64.77,46.99
  Bottom 0.254: MIC3.6 12.06,45.72 v19.68,45.72 | v64.77,46.99 v76.83,46.99
INTER_4  (via drill 0.35)
  Top 0.254: MIC4.6 12.7,27.3 14.61,27.3 v16.51,29.21 | v41.91,29.21 v72.39,29.21 | v74.93,31.11 89.53,45.72 SWITCH.PC7
  Bottom 0.254: v16.51,29.21 v41.91,29.21 | v72.39,29.21 73.03,29.21 v74.93,31.11
INTER_5  (via drill 0.35)
  Top 0.254: MIC5.6 12.06,10.79 12.7,10.16 14.61,10.16 20.32,15.88 20.32,22.86 21.59,24.13 v76.83,24.13 | v81.92,24.13 95.89,38.1 95.89,41.27 SWITCH.PA9
  Bottom 0.254: v76.83,24.13 v81.92,24.13
LED_B
  Top 0.254: SWITCH.PC6 100.97,66.04 102.23,67.31 102.23,87.88 LED_B.+
LED_G
  Top 0.254: SWITCH.PC8 100.33,78.99 LED_G.+
MIC_SIG_0
  Top 0.254: R19.2 R20.2 C11.1
  Top 0.305: C11.1 72.39,77.47 72.11,77.75 MUX.9
MIC_SIG_1  (via drill 0.35)
  Top 0.254: MUX.4 67.22,81 64.9,83.32 | 64.9,83.32 R39.2 | MIC1.3 16.51,85.72 19.05,83.19 19.05,74.3 | 19.05,74.3 20.32,73.03 33.66,73.03 36.83,76.2 48.26,76.2 55.24,83.19 64.77,83.19 64.9,83.32 | 19.05,74.3 v19.05,73.66 | v20.95,67.94 20.95,61.33 R14.1
  Bottom 0.254: v19.05,73.66 20.95,71.75 v20.95,67.94
MIC_SIG_2  (via drill 0.35)
  Top 0.254: MUX.5 66.33,80.35 66.04,80.64 | 66.04,80.64 64.77,81.92 R38.2 | MIC2.3 15.24,67.94 19.68,72.39 34.29,72.39 37.47,75.56 48.9,75.56 53.98,80.64 66.04,80.64 | v19.68,66.67 19.68,59.05 20.32,58.42 R15.1
  Bottom 0.254: v19.68,66.67 18.41,67.94 MIC2.3
MIC_SIG_3  (via drill 0.35)
  Top 0.254: MUX.6 65.09,79.7 64.77,79.38 64.14,79.38 | 64.14,79.38 R37.2 | v19.68,55.88 R16.1 | MIC3.3 17.14,53.34 17.14,58.42 | 17.14,58.42 17.14,68.58 20.32,71.75 34.92,71.75 38.1,74.93 49.53,74.93 52.7,78.11 62.87,78.11 64.14,79.38 | v16.51,58.42 17.14,58.42
  Bottom 0.254: v19.68,55.88 17.14,58.42 v16.51,58.42
MIC_SIG_4  (via drill 0.35)
  Top 0.254: MUX.7 65.98,79.05 63.95,77.02 | 63.95,77.02 R36.2 | MIC4.3 17.78,36.2 17.78,50.8 | 17.78,50.8 17.78,67.94 20.95,71.12 35.56,71.12 38.73,74.3 50.16,74.3 51.44,75.56 62.87,75.56 63.95,76.65 63.95,77.02 | 17.78,50.8 v17.14,51.44 | v19.68,53.34 R17.1
  Bottom 0.254: v17.14,51.44 17.78,51.44 v19.68,53.34
MIC_SIG_5
  Top 0.254: MUX.8 67.87,78.4 63.95,74.48 | 63.95,74.48 R35.2 | MIC5.3 16.51,14.61 18.41,16.51 18.41,49.53 | 18.41,49.53 19.68,50.8 R18.1 | 18.41,49.53 18.41,67.31 21.59,70.48 36.2,70.48 39.37,73.66 50.16,73.66 50.8,73.03 62.87,73.03 63.95,74.11 63.95,74.48
MUX_S0
  Top 0.254: MUX.10 67.89,77.1 66.36,75.56 66.36,67.63 66.04,67.31 38.1,67.31 SWITCH.PC12
MUX_S1
  Top 0.254: MUX.11 68.19,76.45 67.31,75.56 67.31,65.41 66.67,64.77 48.26,64.77 46.99,66.04 SWITCH.PD2
MUX_S2  (via drill 0.35)
  Top 0.254: MUX.14 79.12,76.45 79.38,76.2 v79.38,50.16 | v75.56,50.16 75.56,49.53 60.33,34.29 38.1,34.29 SWITCH.PH0
  Bottom 0.254: v79.38,50.16 v75.56,50.16
MUX_S3
  Top 0.254: MUX.13 78.5,75.8 78.74,75.56 78.74,51.52 58.97,31.75 38.1,31.75 SWITCH.PH1
N$1
  Top 0.254: R12.1 DSP_FILTER.PA10
N$2
  Top 5.08: J3.PWR 66.04,15.88 67.31,17.14 73.66,17.14 78.11,12.7 D1.A D3.1
N$3
  Top 0.305: SW1.4 124.14,90.49 124.46,90.81 124.46,92.08 124.72,92.34 R3.2
N$4
  Top 0.305: AD8655.3 126,90.81 R3.1
N$5
  Top 0.305: R2.2 128.91,95.89 127.64,94.61 127.64,92.71 128.27,92.08 AD8655.2
N$6
  Top 0.254: R7.1 39.63,83.72 35.09,88.27 J1.S
N$7
  Top 0.305: C4.1 R4.2 | C4.1 R5.2 | C4.1 122.19,88 121.28,88.9 119.38,88.9 118.75,89.53 118.75,90.17 119.06,90.49 SW1.3
N$8
  Top 0.305: R10.2 C9.1 | C9.1 R11.2 | C9.1 122.19,68.95 120.02,71.12 119.38,71.12 118.75,71.75 118.75,72.39 119.06,72.71 SW2.3
N$9
  Top 0.254: J2.3 32.65,31.11 R6.2
N$10
  Top 0.254: R14.2 MICS.1
N$11
  Top 0.254: LED_G.- 81.66,92.72 R8.2
N$12
  Top 0.254: LED_B.- 92.46,92.72 R9.2
N$13
  Top 0.254: R15.2 MICS.2
N$14
  Top 0.254: R16.2 MICS.3
N$15
  Top 0.254: R17.2 MICS.4
N$16
  Top 0.254: R18.2 MICS.5
N$17
  Top 0.305: R40.2 J4.2
N$18
  Top 0.305: AD1.2 128.27,74.3 127.64,74.93 127.64,76.83 128.91,78.11 R21.2
N$19
  Top 0.305: AD2.2 128.27,56.52 127.64,57.15 127.64,59.05 128.91,60.33 R23.2
N$20
  Top 0.305: AD1.3 127.64,73.03 126.1,74.56 R22.1
N$21
  Top 0.305: AD2.3 128.27,55.24 126.73,56.78 R24.1
N$22
  Top 0.305: AD3.2 128.27,38.73 127.64,39.37 127.64,41.27 128.91,42.55 R25.2
N$23
  Top 0.305: AD3.3 128.27,37.47 126.73,39 R26.1
N$24
  Top 0.305: AD4.2 128.27,20.95 127.64,21.59 127.64,23.5 128.91,24.77 R27.2
N$25
  Top 0.305: AD4.3 128.27,19.68 126.73,21.22 R28.1
N$26
  Top 0.305: R29.2 C15.1 | C15.1 R30.2 | SW3.3 119.06,54.93 118.75,54.61 118.75,53.98 119.38,53.34 120.65,53.34 122.19,51.8 C15.1
N$27
  Top 0.305: SW2.4 125.68,72.71 R22.2
N$28
  Top 0.305: R31.2 C16.1 | C16.1 R32.2 | SW4.3 119.06,37.15 118.75,36.83 118.75,36.2 119.38,35.56 120.65,35.56 122.19,34.02 C16.1
N$29
  Top 0.305: R24.2 122.64,54.98 SW3.4
N$30
  Top 0.305: R33.2 C17.1 | C17.1 R34.2 | C17.1 122.19,16.25 120.65,17.78 119.38,17.78 118.75,18.41 118.75,19.05 119.06,19.37 SW5.3
N$31
  Top 0.305: R26.2 122.64,37.2 SW4.4
N$32
  Top 0.305: R13.2 J4.3
N$33
  Top 0.305: R28.2 122.64,19.42 SW5.4
N$34
  Top 0.254: R46.1 J4.1
N$35
  Top 0.305: LED_G1.- R41.1
N$37
  Top 0.305: R42.1 LED_G2.-
N$39
  Top 0.305: LED_G3.- 136.27,48.27 R43.1
N$41
  Top 0.305: LED_G4.- R44.1
N$43
  Top 0.305: LED_G5.- 136.27,12.71 R45.1
RESET  (via drill 0.35)
  Top 0.254: R6.1 33.02,42.55 v34.29,43.81
  Bottom 0.254: v34.29,43.81 34.29,50.8 35.56,52.07 38.1,52.07 SWITCH.RESET
SIG_IN_DSP
  Top 0.254: R40.1 46.99,80.01 55.88,88.9 64.77,88.9 66.67,87 66.67,83.82 67.55,82.95 MUX.1 71.99,82.95 73.66,81.28 73.66,53.34 55.88,35.56 DSP_FILTER.PA0
SIG_OUT_DSP  (via drill 0.35)
  Top 0.254: R13.1 46.35,77.47 56.52,87.63 v64.14,87.63 | v115.57,87.63 116.2,87.63 116.84,87
  Top 0.305: SW1.1 117.79,92.39 116.84,91.44 116.84,87 116.84,74.3 | 116.84,38.73 116.84,22.86 115.25,21.27 | 116.84,38.73 116.84,56.52 | 116.84,56.52 116.84,74.3 | SW2.1 117.16,74.61 116.84,74.3 | SW3.1 117.16,56.83 116.84,56.52 | SW4.1 117.16,39.05 116.84,38.73 | SW5.1 115.25,21.27 | 115.25,21.27 114.3,21.27 82.23,21.27 73.03,30.48 DSP_FILTER.PA4
  Bottom 0.254: v64.14,87.63 v115.57,87.63
SPK_SIG_1
  Top 0.305: AD8655.6 137.79,90.81 | 137.79,90.81 SPK1.8 | R2.1 136.53,95.89 138.43,93.98 138.43,91.44 137.79,90.81
SPK_SIG_2
  Top 0.305: AD1.6 137.79,73.03 | 137.79,73.03 SPK2.8 | 137.79,73.03 138.43,73.66 138.43,76.2 136.53,78.11 R21.1
SPK_SIG_3
  Top 0.305: AD2.6 137.79,55.24 | 137.79,55.24 SPK3.8 | 137.79,55.24 138.43,55.88 138.43,58.42 136.53,60.33 R23.1
SPK_SIG_4
  Top 0.305: AD3.6 137.79,37.47 | 137.79,37.47 SPK4.8 | 137.79,37.47 138.43,38.1 138.43,40.01 135.89,42.55 R25.1
SPK_SIG_5
  Top 0.305: AD4.6 137.79,19.68 | 137.79,19.68 SPK5.8 | 137.79,19.68 138.43,20.32 138.43,22.86 136.53,24.77 R27.1
SW_DSP_I
  Top 0.254: SWITCH.PA10 98.53,27.94 99.8,29.21 100.86,29.21 102.13,27.94 R12.2
SW_RX
  Top 0.305: SWITCH.PC11 DSP_FILTER.PC10
SW_TX
  Top 0.305: SWITCH.PC10 36.83,69.22 38.1,70.48 50.16,70.48 DSP_FILTER.PC11
TRIG  (via drill 0.35)
  Top 0.254: SWITCH.PA15 34.29,50.8 v34.29,52.7 | v34.29,59.69 v34.29,69.22 | v33.02,74.3 34.29,75.56 34.29,81.55 35.19,82.44 R46.2 R7.2
  Bottom 0.254: v34.29,52.7 v34.29,59.69 | v34.29,69.22 33.02,70.48 v33.02,74.3
U5V
  Bottom 0.254: DSP_FILTER.U5V 112.29,60.96 111.02,59.69 109.96,59.69 108.69,60.96 SWITCH.U5V
VBAT_C
  Top 0.254: SWITCH.VBAT_C 37.57,27.94 38.84,29.21 39.9,29.21 41.17,27.94 DSP_FILTER.VBAT_C
VDD
  Top 0.254: DSP_FILTER.VDD 47.62,63.5 46.35,64.77 38.1,64.77 SWITCH.VDD
VIN
  Top 0.254: DSP_FILTER.VIN 50.8,41.91 40.64,41.91 SWITCH.VIN

### Text on the board
tPlace: TRG | DSP_IN | DSP_OUT | GND | M1 | M2 | M3 | M4 | M5 | G | RST | E5V | GND | RST | 36V 5A | ReSpeaker Switch V02